# Altium project MPG2.PrjPcb
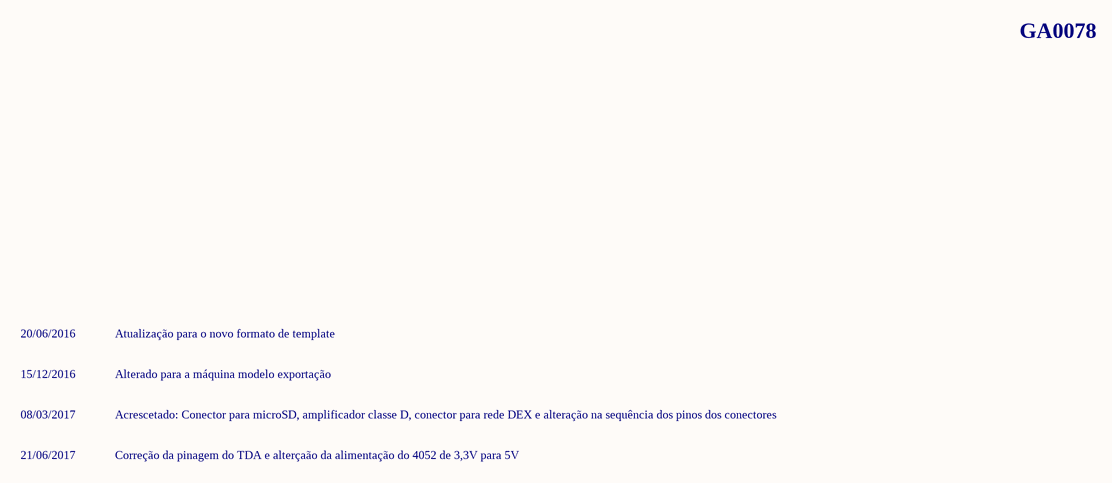
[diagram p0: Capa.SchDoc]
10 sheets, 183 parts. Net scope: global (net labels, ports and power ports of the same name join across sheets).
Sheets:
  Capa.SchDoc
  Controle_Cupula.SchDoc
  Controle_placa_potencia.SchDoc
  ControleEmbalagem.SchDoc
  ControleLeds.SchDoc
  Entrada_comestero_rm5.SchDoc
  Interface_gratis.SchDoc
  InterfaceConfiguracao.SchDoc
  Memoria.SchDoc
  Porta_MDB.SchDoc

## Sheet Capa.SchDoc: CONTROLADORA MAIS PIPOCA - REVISÃO EMC
size A3; Author: Marcos Aquino; DocumentNumber: 1; SheetNumber: 1; SheetTotal: 17; PageSetup: Record=PageOptions|CenterHorizontal=True|CenterVertical=True|PrintScale=0.71|XCorrection=1.00|YCorrection=1.00|PrintKind=0|BorderSize=5000000|LeftOffset=0|BottomOffset=0|Orientation=2|PaperLength=1000|PaperWidth=1000|Scale=100|PaperSource=7|PrintQuality=-3|MediaType=1|DitherType=10|PrintScaleMode=1|PaperKind=A4|PaperIndex=9

### Notes on the sheet
- GA0078
- 20/06/2016
- 15/12/2016
- Atualização para o novo formato de template
- Alterado para a máquina modelo exportação
- 08/03/2017
- Acrescetado: Conector para microSD, amplificador classe D, conector para rede DEX e alteração na sequência dos pinos dos conectores
- 21/06/2017
- Correção da pinagem do TDA e alterçaão da alimentação do 4052 de 3,3V para 5V
- Código
- Quark Tecnologia Eletrônica Ltda.
- Rua 216, nº 238 - Sala 01 - Meia Praia - Itapema/SC
- Observações
- (47) 3246-6352  -
- www.quarktee.com.br
- contato@quarktee.com.br
- Projeto
- Quantidade de Páginas
- Revisão
- Projetista
- Local arquivos no servidor
- Data
- Modificação
- Solicitador por:
- Executador por:
- Aprovado por:

## Sheet Controle_Cupula.SchDoc: CONTROLADORA MAIS PIPOCA - REVISÃO EMC
size A3; DocumentNumber: GA0078; SheetNumber: 6; SheetTotal: 17
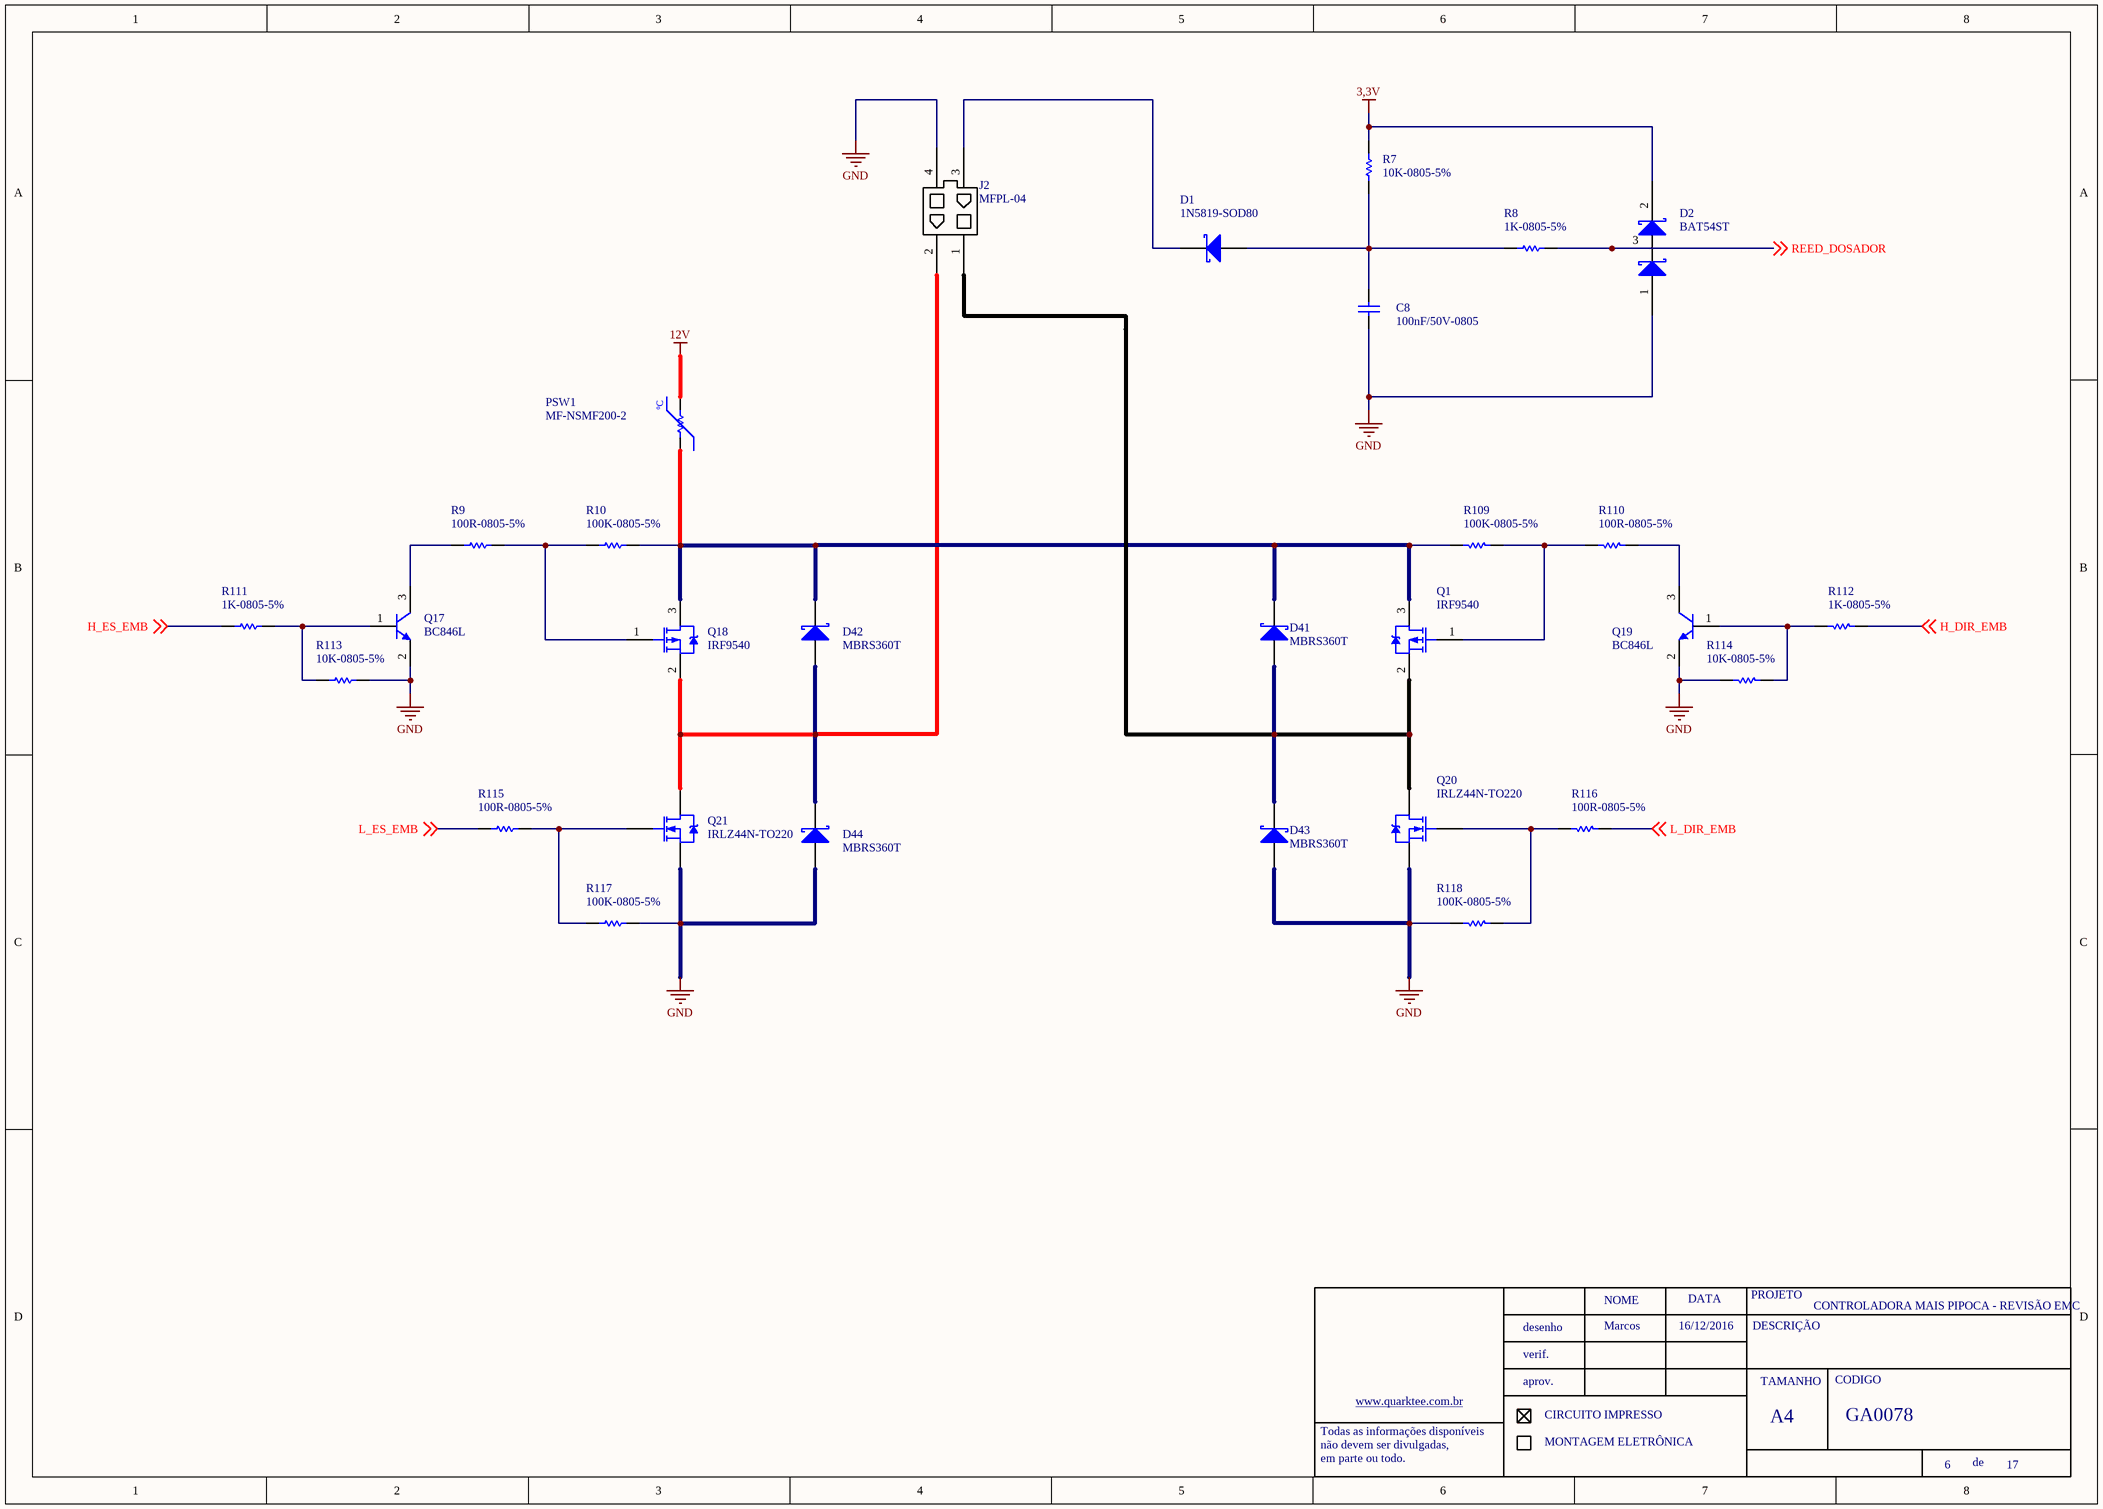
[diagram p1: Controle_Cupula.SchDoc]

### Parts
C8  100nF/50V-0805  [0805-REVISADO ONDA]
D1  1N5819-SOD80  [MINIMLEF/SOD80 - REVISADO ONDA]
D2  BAT54ST  [SOT23 - REVISADO ONDA]
D41  MBRS360T  [DO-214AB]
D42  MBRS360T  [DO-214AB]
D43  MBRS360T  [DO-214AB]
D44  MBRS360T  [DO-214AB]
J2  MFPL-04
PSW1  MF-NSMF200-2  [1206-REVISADO ONDA]
Q1  IRF9540  [TO220-3 EM PÉ]
Q17  BC846L  [SOT23 - REVISADO ONDA]
Q18  IRF9540  [TO220-3 EM PÉ]
Q19  BC846L  [SOT23 - REVISADO ONDA]
Q20  IRLZ44N-TO220  [TO220-3 EM PÉ]
Q21  IRLZ44N-TO220  [TO220-3 EM PÉ]
R7  10K-0805-5%  [0805-REVISADO ONDA]
R8  1K-0805-5%  [0805-REVISADO ONDA]
R9  100R-0805-5%  [0805-REVISADO ONDA]
R10  100K-0805-5%  [0805-REVISADO ONDA]
R109  100K-0805-5%  [0805-REVISADO ONDA]
R110  100R-0805-5%  [0805-REVISADO ONDA]
R111  1K-0805-5%  [0805-REVISADO ONDA]
R112  1K-0805-5%  [0805-REVISADO ONDA]
R113  10K-0805-5%  [0805-REVISADO ONDA]
R114  10K-0805-5%  [0805-REVISADO ONDA]
R115  100R-0805-5%  [0805-REVISADO ONDA]
R116  100R-0805-5%  [0805-REVISADO ONDA]
R117  100K-0805-5%  [0805-REVISADO ONDA]
R118  100K-0805-5%  [0805-REVISADO ONDA]

### Nets
3,3V: D2.2 R7.2
12V: PSW1.2
GND: C8.1 D2.1 D43.1(A) D44.1(A) J2.4 Q17.2(E) Q19.2(E) Q20.3(S) Q21.3(S) R113.2 R114.2 R117.2 R118.2
H_DIR_EMB: R112.1 ; off-sheet H_DIR_EMB
H_ES_EMB: R111.1 ; off-sheet H_ES_EMB
L_DIR_EMB: R116.1 ; off-sheet L_DIR_EMB
L_ES_EMB: R115.1 ; off-sheet L_ES_EMB
REED_DOSADOR: D2.3 R8.2 ; off-sheet REED_DOSADOR
NetC8_2: C8.2 D1.1(A) R7.1 R8.1
NetD1_2: D1.2(K) J2.3
NetD41_1: D41.1(A) D43.2(K) J2.1 Q1.2(DRENO) Q20.2(D)
NetD41_2: D41.2(K) D42.2(K) PSW1.1 Q1.3(SOURCE) Q18.3(SOURCE) R10.2 R109.2
NetD42_1: D42.1(A) D44.2(K) J2.2 Q18.2(DRENO) Q21.2(D)
NetQ1_1: Q1.1(GATE) R109.1 R110.2
NetQ17_1: Q17.1(B) R111.2 R113.1
NetQ17_3: Q17.3(C) R9.1
NetQ18_1: Q18.1(GATE) R9.2 R10.1
NetQ19_1: Q19.1(B) R112.2 R114.1
NetQ19_3: Q19.3(C) R110.1
NetQ20_1: Q20.1(G) R116.2 R118.1
NetQ21_1: Q21.1(G) R115.2 R117.1

### Notes on the sheet
- Marcos
- 16/12/2016
- NOME
- DATA
- PROJETO
- DESCRIÇÃO
- desenho
- verif.
- aprov.
- TAMANHO
- CODIGO
- Todas as informações disponíveis
- não devem ser divulgadas,
- em parte ou todo.
- www.quarktee.com.br
- CIRCUITO IMPRESSO
- MONTAGEM ELETRÔNICA
- A4
- de
- (in symbol POLYSWITCH 200mA) ºC

### Library data of the parts
C8 = 100nF/50-0805-NPO: ERP: 104.11.005
D41-D44 = 1N5819-SOD80: ERP: 121.18.003
PSW1 = POLYSWITCH 200mA: NANOSMDC020F-2; ERP: 128.12.002
Q17 Q19 = BC846: ERP: 106.22.001
R9 R110 = 1K-0805-5%: ERP: 102.11.042
R111 R112 = 10K-0805-5%: ERP: 102.11.054
D1 = 1N5819-SOD80: ERP: 121.18.003
Q20 Q21 = IRLZ44N-TO220: ERP: 107.01.006
R7 R113 R114 = 10K-0805-5%: ERP: 102.11.054
R8 = 1K-0805-5%: ERP: 102.11.042
R10 R109 R117 R118 = 100K-0805-5%: ERP: 102.11.066
R115 R116 = 100R-0805-5%: ERP: 102.11.031

## Sheet Controle_placa_potencia.SchDoc: CONTROLADORA MAIS PIPOCA - REVISÃO EMC
size A3; DocumentNumber: GA0078; SheetNumber: 8; SheetTotal: 17
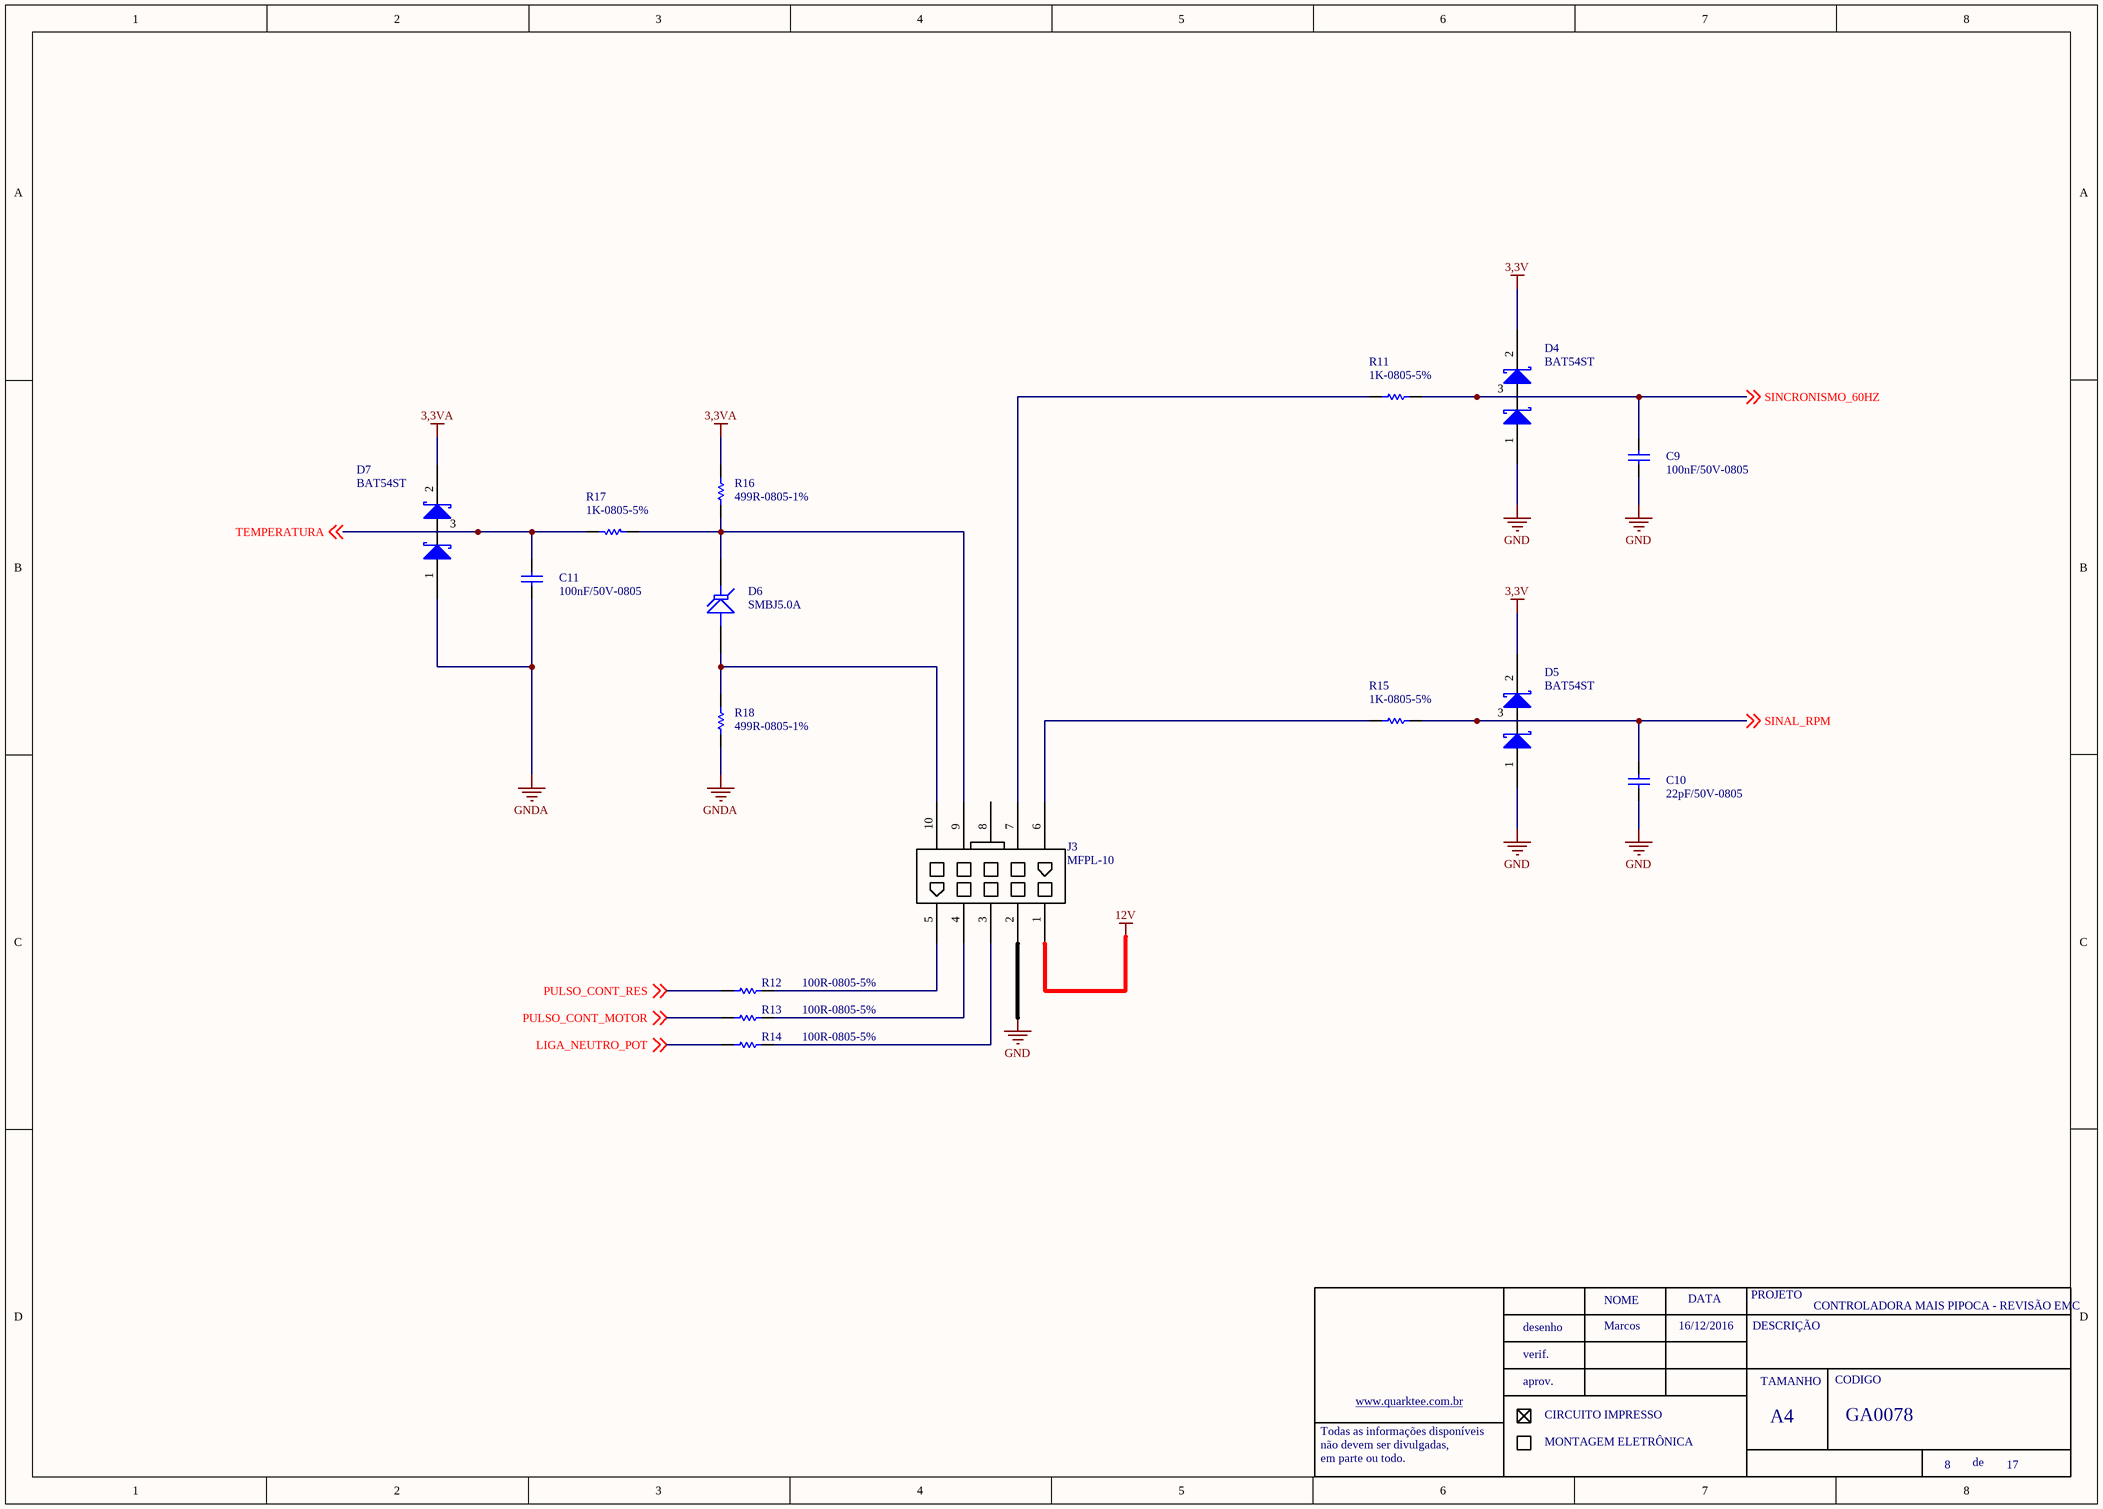
[diagram p2: Controle_placa_potencia.SchDoc]

### Parts
C9  100nF/50V-0805  [0805-REVISADO ONDA]
C10  22pF/50V-0805  [0805-REVISADO ONDA]
C11  100nF/50V-0805  [0805-REVISADO ONDA]
D4  BAT54ST  [SOT23 - REVISADO ONDA]
D5  BAT54ST  [SOT23 - REVISADO ONDA]
D6  SMBJ5.0A  [SMA DIODES]
D7  BAT54ST  [SOT23 - REVISADO ONDA]
J3  MFPL-10
R11  1K-0805-5%  [0805-REVISADO ONDA]
R12  100R-0805-5%  [0805-REVISADO ONDA]
R13  100R-0805-5%  [0805-REVISADO ONDA]
R14  100R-0805-5%  [0805-REVISADO ONDA]
R15  1K-0805-5%  [0805-REVISADO ONDA]
R16  499R-0805-1%  [0805-REVISADO ONDA]
R17  1K-0805-5%  [0805-REVISADO ONDA]
R18  499R-0805-1%  [0805-REVISADO ONDA]

### Nets
3,3V: D4.2 D5.2
3,3VA: D7.2 R16.2
12V: J3.1
GND: C9.2 C10.2 D4.1 D5.1 J3.2
GNDA: C11.1 D7.1 R18.1
LIGA_NEUTRO_POT: R14.1 ; off-sheet LIGA_NEUTRO_POT
PULSO_CONT_MOTOR: R13.1 ; off-sheet PULSO_CONT_MOTOR
PULSO_CONT_RES: R12.2 ; off-sheet PULSO_CONT_RES
SINAL_RPM: C10.1 D5.3 R15.2 ; off-sheet SINAL_RPM
SINCRONISMO_60HZ: C9.1 D4.3 R11.2 ; off-sheet SINCRONISMO_60HZ
TEMPERATURA: C11.2 D7.3 R17.2 ; off-sheet TEMPERATURA
NetD6_1: D6.1(A) J3.10 R18.2
NetD6_2: D6.2(K) J3.9 R16.1 R17.1
NetJ3_3: J3.3 R14.2
NetJ3_4: J3.4 R13.2
NetJ3_5: J3.5 R12.1
NetJ3_6: J3.6 R15.1
NetJ3_7: J3.7 R11.1

Not connected (* = marked no-connect by the designer): J3 8

### Notes on the sheet
- Marcos
- 16/12/2016
- NOME
- DATA
- PROJETO
- DESCRIÇÃO
- desenho
- verif.
- aprov.
- TAMANHO
- CODIGO
- Todas as informações disponíveis
- não devem ser divulgadas,
- em parte ou todo.
- www.quarktee.com.br
- CIRCUITO IMPRESSO
- MONTAGEM ELETRÔNICA
- A4
- de

### Library data of the parts
C9 C11 = 100nF/50-0805-NPO: ERP: 104.11.005
C10 = 100nF/50-0805-NPO: 100nF/50V-0805; ERP: 104.11.005
R16 R18 = 10K-0805-5%: ERP: 102.11.054
D6 = SMBJ5.0A: ERP: 128.02.002
R11 R15 R17 = 1K-0805-5%: ERP: 102.11.042
R12-R14 = 100R-0805-5%: ERP: 102.11.031

## Sheet ControleEmbalagem.SchDoc: CONTROLADORA MAIS PIPOCA - REVISÃO EMC
size A3; DocumentNumber: GA0078; SheetNumber: 5; SheetTotal: 17
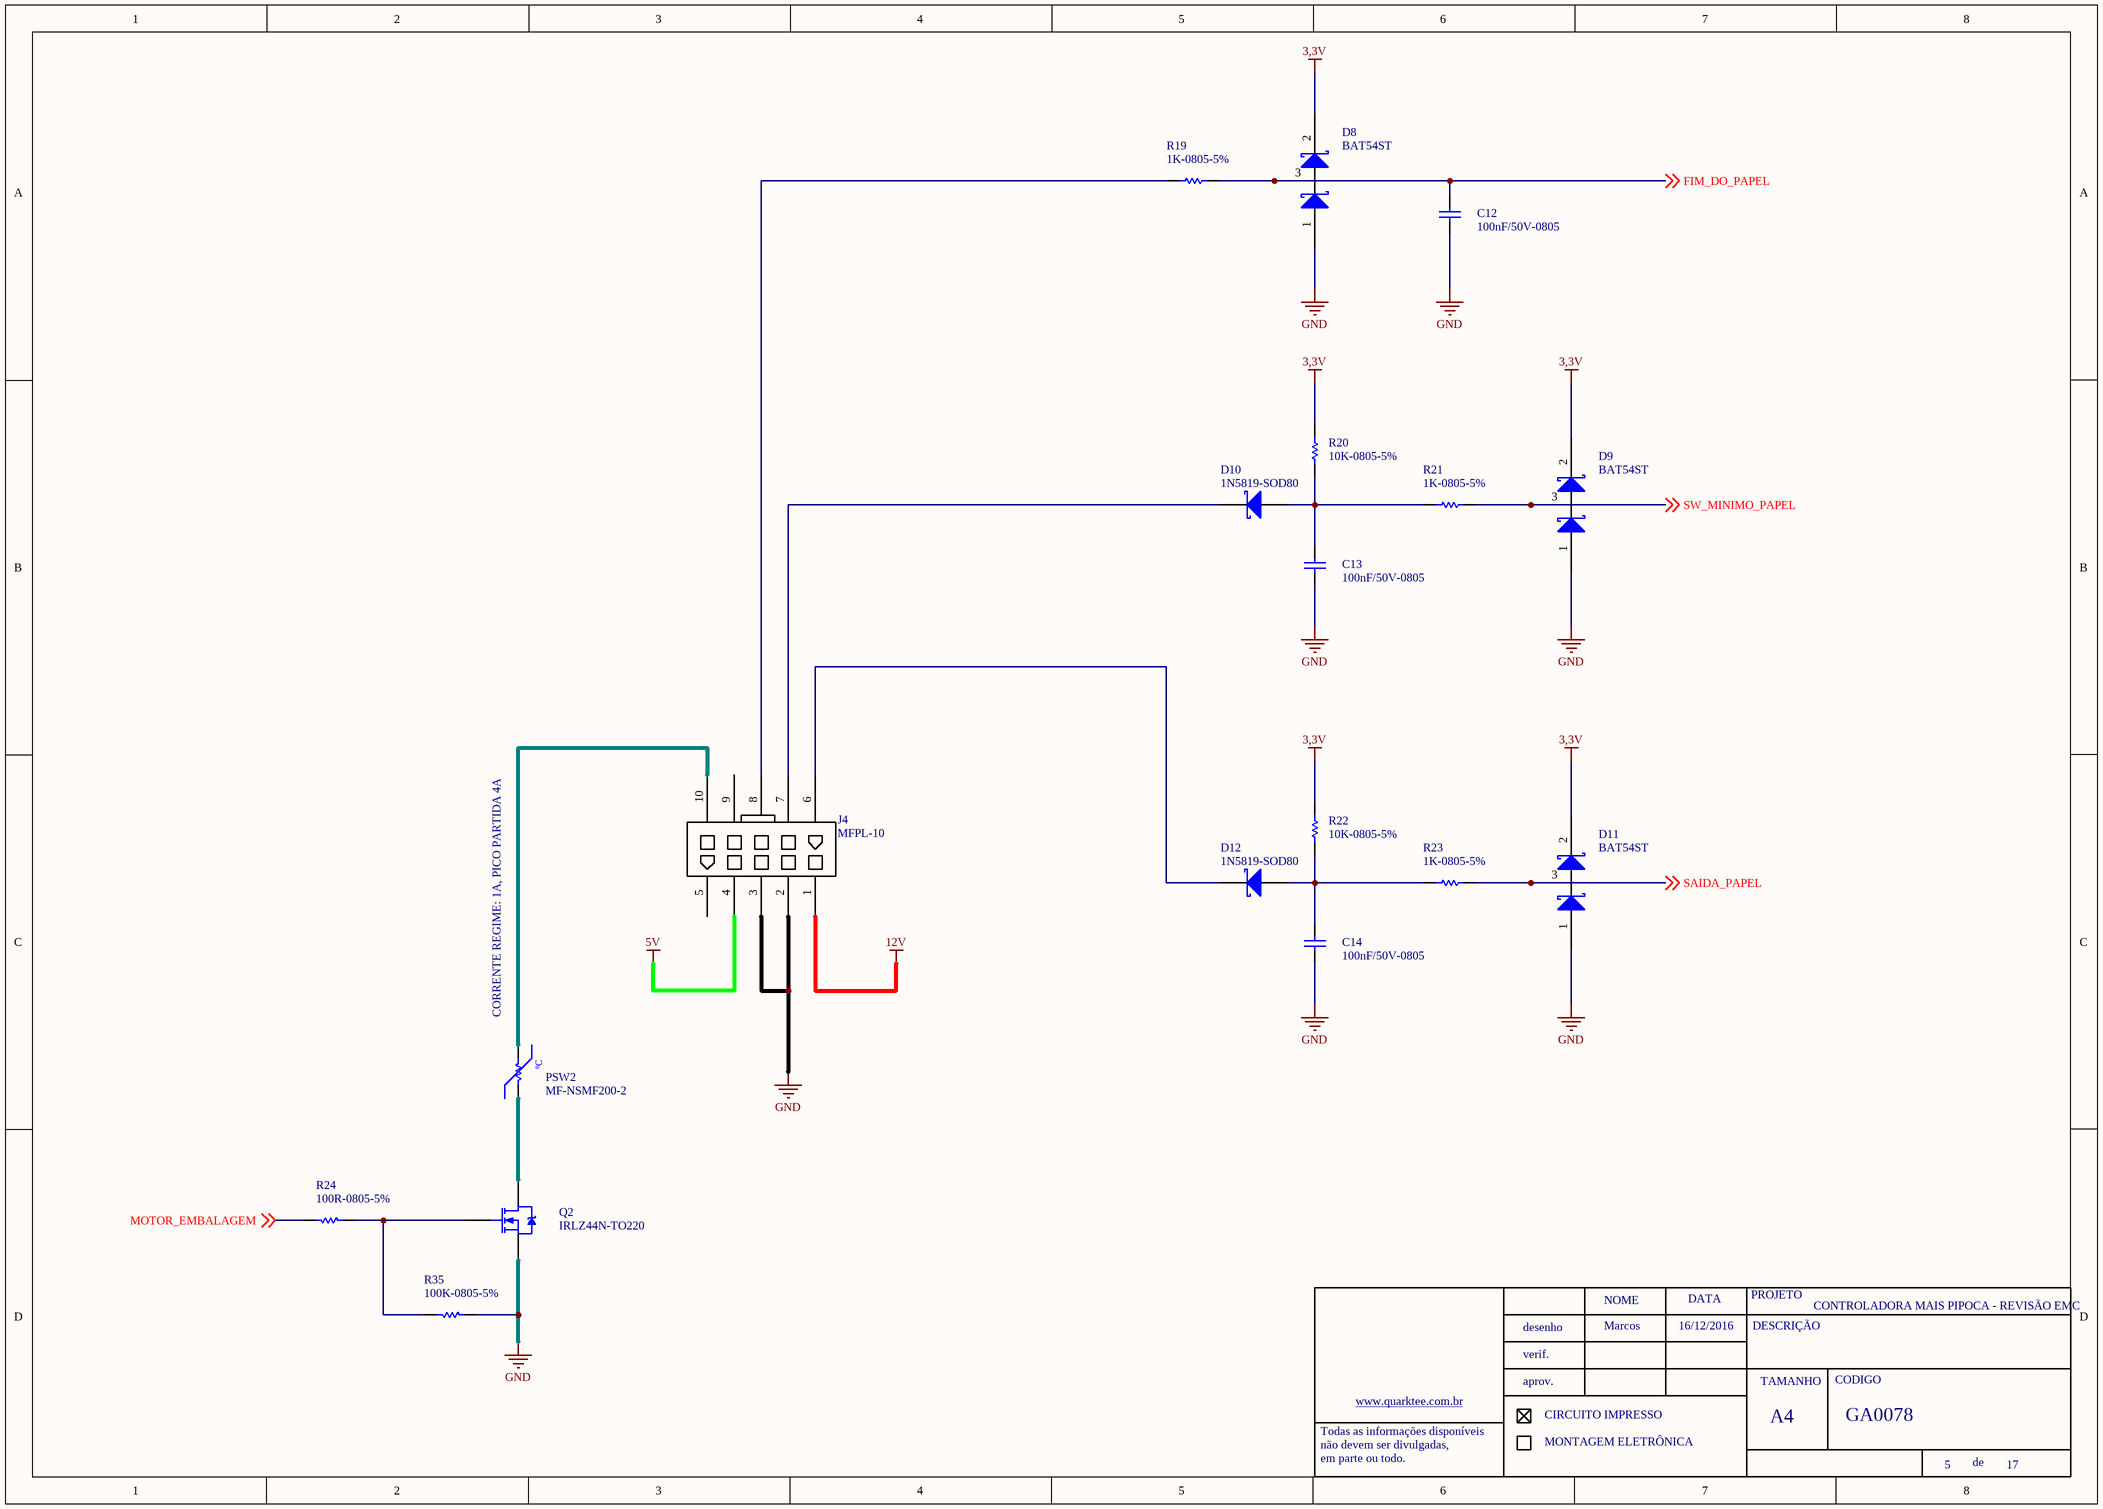
[diagram p3: ControleEmbalagem.SchDoc]

### Parts
C12  100nF/50V-0805  [0805-REVISADO ONDA]
C13  100nF/50V-0805  [0805-REVISADO ONDA]
C14  100nF/50V-0805  [0805-REVISADO ONDA]
D8  BAT54ST  [SOT23 - REVISADO ONDA]
D9  BAT54ST  [SOT23 - REVISADO ONDA]
D10  1N5819-SOD80  [MINIMLEF/SOD80 - REVISADO ONDA]
D11  BAT54ST  [SOT23 - REVISADO ONDA]
D12  1N5819-SOD80  [MINIMLEF/SOD80 - REVISADO ONDA]
J4  MFPL-10
PSW2  MF-NSMF200-2  [1206-REVISADO ONDA]
Q2  IRLZ44N-TO220  [TO220-3 EM PÉ]
R19  1K-0805-5%  [0805-REVISADO ONDA]
R20  10K-0805-5%  [0805-REVISADO ONDA]
R21  1K-0805-5%  [0805-REVISADO ONDA]
R22  10K-0805-5%  [0805-REVISADO ONDA]
R23  1K-0805-5%  [0805-REVISADO ONDA]
R24  100R-0805-5%  [0805-REVISADO ONDA]
R35  100K-0805-5%  [0805-REVISADO ONDA]

### Nets
3,3V: D8.2 D9.2 D11.2 R20.2 R22.2
5V: J4.4
12V: J4.1
GND: C12.1 C13.1 C14.1 D8.1 D9.1 D11.1 J4.2 J4.3 Q2.3(S) R35.1
FIM_DO_PAPEL: C12.2 D8.3 R19.2 ; off-sheet FIM_DO_PAPEL
MOTOR_EMBALAGEM: R24.2 ; off-sheet MOTOR_EMBALAGEM
SAIDA_PAPEL: D11.3 R23.2 ; off-sheet SAIDA_PAPEL
SW_MINIMO_PAPEL: D9.3 R21.2 ; off-sheet SW_MINIMO_PAPEL
NetC13_2: C13.2 D10.1(A) R20.1 R21.1
NetC14_2: C14.2 D12.1(A) R22.1 R23.1
NetD10_2: D10.2(K) J4.7
NetD12_2: D12.2(K) J4.6
NetJ4_8: J4.8 R19.1
NetJ4_10: J4.10 PSW2.2
NetPSW2_1: PSW2.1 Q2.2(D)
NetQ2_1: Q2.1(G) R24.1 R35.2

Not connected (* = marked no-connect by the designer): J4 5 9

### Notes on the sheet
- (near PSW2) CORRENTE REGIME: 1A, PICO PARTIDA 4A
- Marcos
- 16/12/2016
- NOME
- DATA
- PROJETO
- DESCRIÇÃO
- desenho
- verif.
- aprov.
- TAMANHO
- CODIGO
- Todas as informações disponíveis
- não devem ser divulgadas,
- em parte ou todo.
- www.quarktee.com.br
- CIRCUITO IMPRESSO
- MONTAGEM ELETRÔNICA
- A4
- de
- (in symbol POLYSWITCH 200mA) ºC

### Library data of the parts
C12-C14 = 100nF/50-0805-NPO: ERP: 104.11.005
PSW2 = POLYSWITCH 200mA: NANOSMDC020F-2; ERP: 128.12.002
D10 D12 = 1N5819-SOD80: ERP: 121.18.003
Q2 = IRLZ44N-TO220: ERP: 107.01.006
R19 R21 R23 = 1K-0805-5%: ERP: 102.11.042
R20 R22 = 10K-0805-5%: ERP: 102.11.054
R24 = 100R-0805-5%: ERP: 102.11.031
R35 = 100K-0805-5%: ERP: 102.11.066

## Sheet ControleLeds.SchDoc: CONTROLADORA MAIS PIPOCA - REVISÃO EMC
size A3; DocumentNumber: GA0078; SheetNumber: 7; SheetTotal: 17
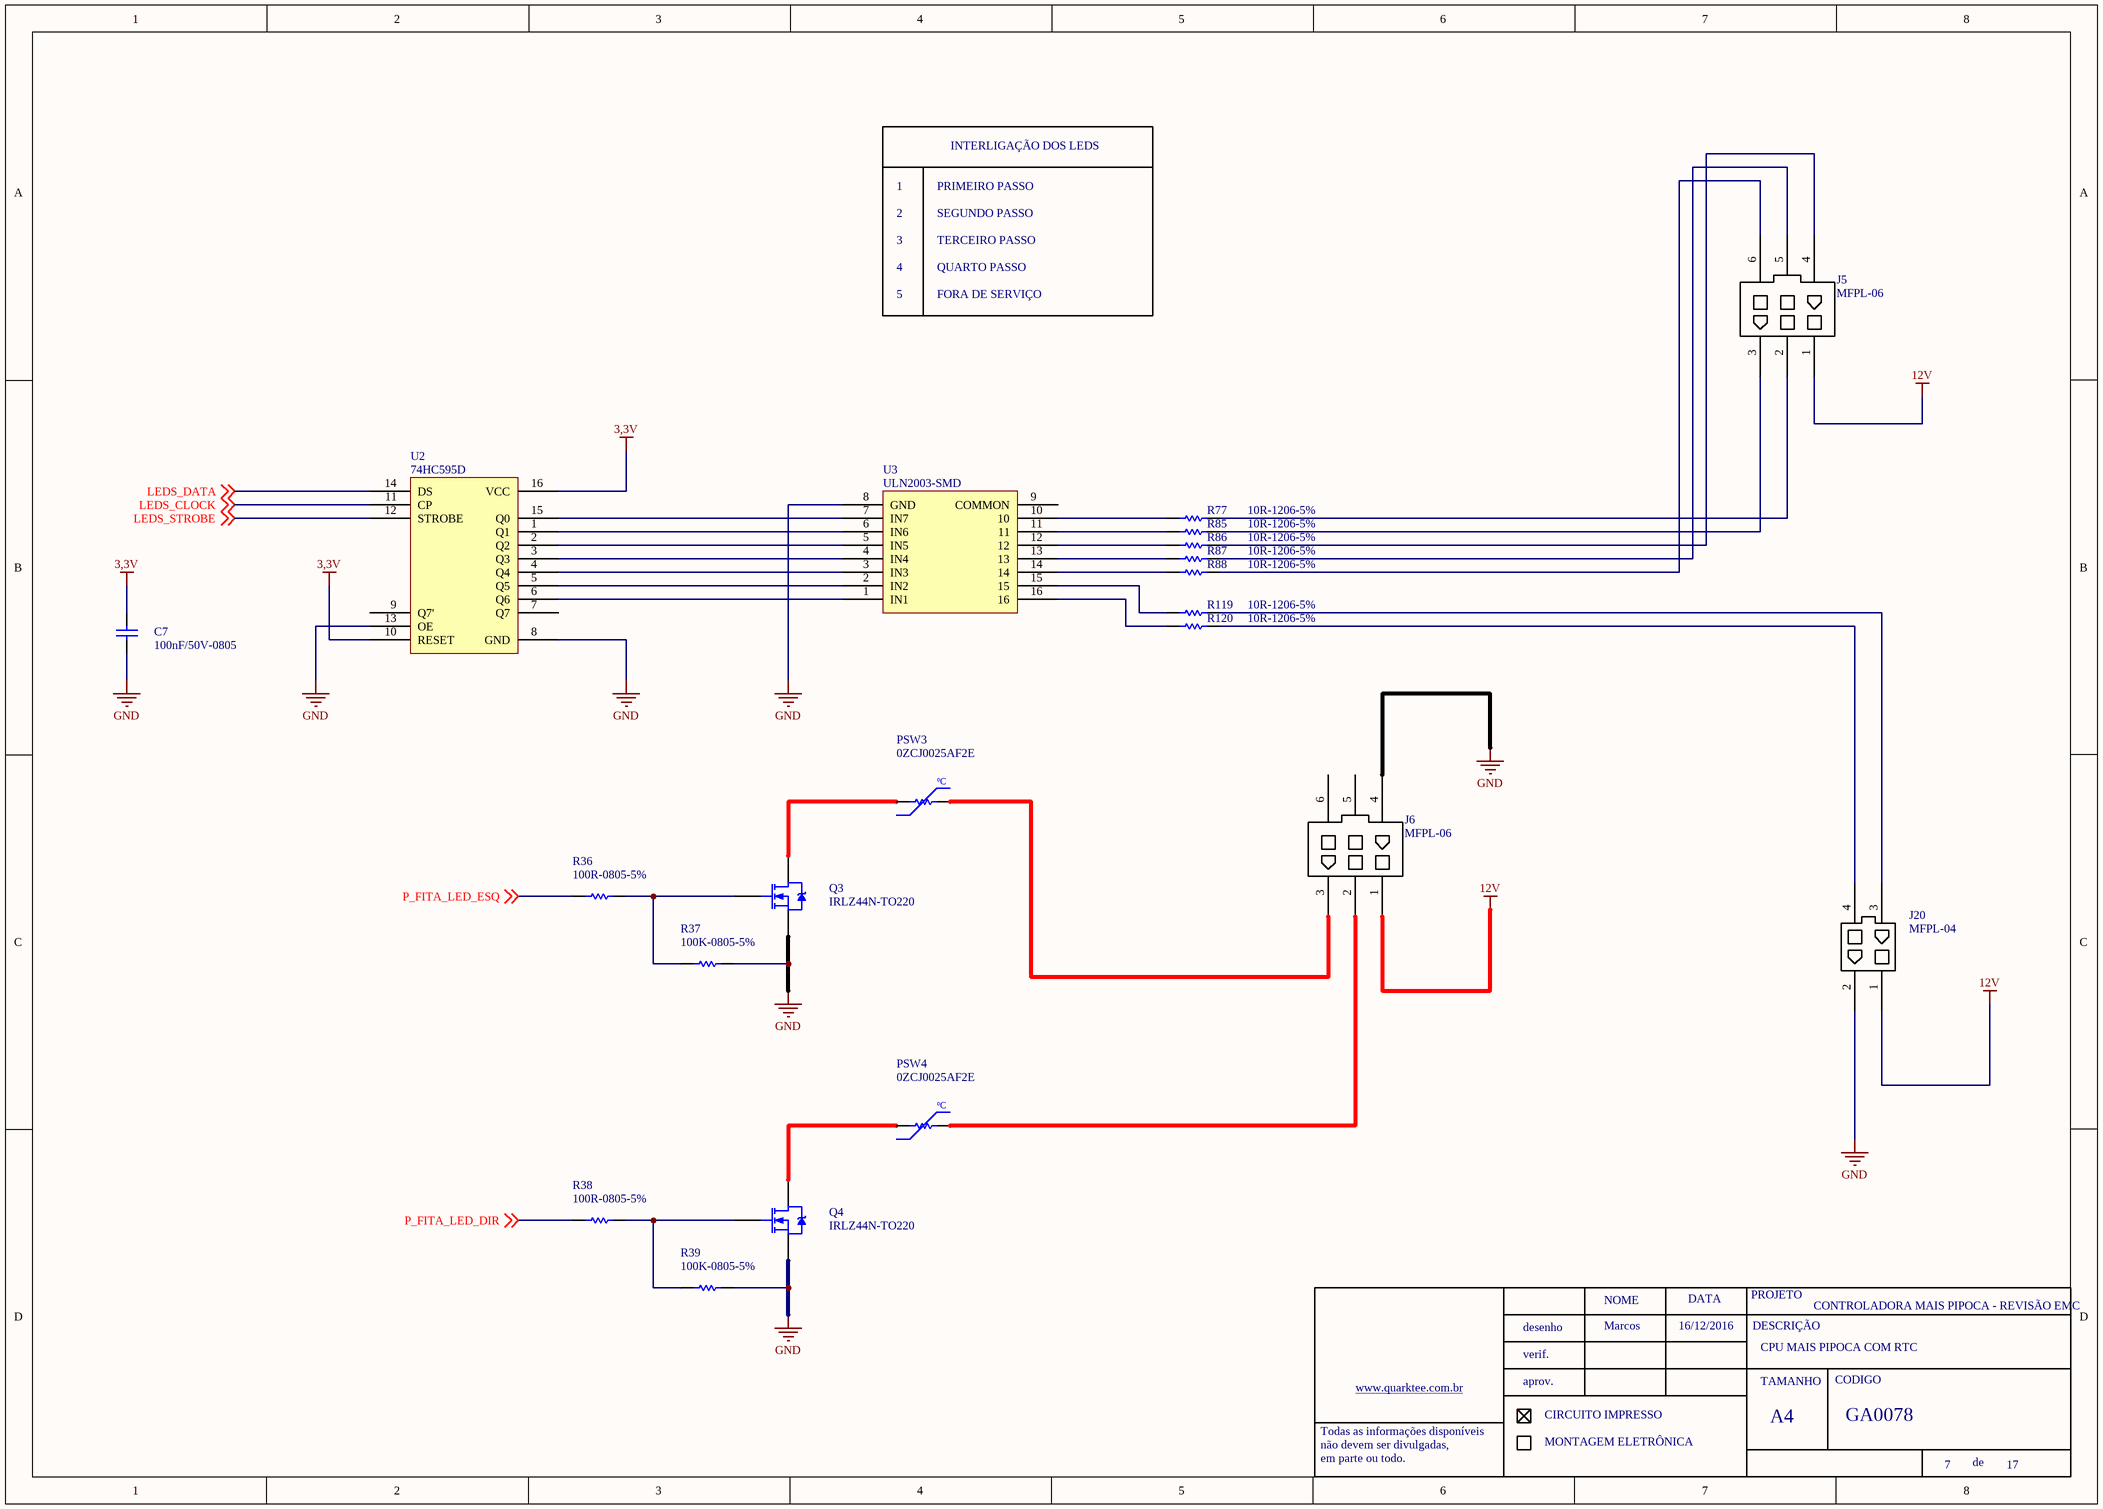
[diagram p4: ControleLeds.SchDoc]

### Parts
C7  100nF/50V-0805  [0805-REVISADO ONDA]
J5  MFPL-06
J6  MFPL-06
J20  MFPL-04
PSW3  0ZCJ0025AF2E  [1206-REVISADO ONDA]
PSW4  0ZCJ0025AF2E  [1206-REVISADO ONDA]
Q3  IRLZ44N-TO220  [TO220-3 EM PÉ]
Q4  IRLZ44N-TO220  [TO220-3 EM PÉ]
R36  100R-0805-5%  [0805-REVISADO ONDA]
R37  100K-0805-5%  [0805-REVISADO ONDA]
R38  100R-0805-5%  [0805-REVISADO ONDA]
R39  100K-0805-5%  [0805-REVISADO ONDA]
R77  10R-1206-5%  [1206-REVISADO ONDA]
R85  10R-1206-5%  [1206-REVISADO ONDA]
R86  10R-1206-5%  [1206-REVISADO ONDA]
R87  10R-1206-5%  [1206-REVISADO ONDA]
R88  10R-1206-5%  [1206-REVISADO ONDA]
R119  10R-1206-5%  [1206-REVISADO ONDA]
R120  10R-1206-5%  [1206-REVISADO ONDA]
U2  74HC595D  [SOIC 16 PINOS]
U3  ULN2003-SMD  [SOIC 16 PINOS]

### Nets
3,3V: C7.2 U2.10(RESET) U2.16(VCC)
12V: J5.1 J6.1 J20.1
GND: C7.1 J6.4 J20.2 Q3.3(S) Q4.3(S) R37.2 R39.2 U2.8(GND) U2.13(OE) U3.8(GND)
LEDS_CLOCK: U2.11(CP) ; off-sheet LEDS_CLOCK
LEDS_DATA: U2.14(DS) ; off-sheet LEDS_DATA
LEDS_STROBE: U2.12(STROBE) ; off-sheet LEDS_STROBE
P_FITA_LED_DIR: R38.1 ; off-sheet P_FITA_LED_DIR
P_FITA_LED_ESQ: R36.1 ; off-sheet P_FITA_LED_ESQ
NetJ5_2: J5.2 R77.2
NetJ5_3: J5.3 R85.2
NetJ5_4: J5.4 R86.2
NetJ5_5: J5.5 R87.2
NetJ5_6: J5.6 R88.2
NetJ6_2: J6.2 PSW4.2
NetJ6_3: J6.3 PSW3.2
NetJ20_3: J20.3 R119.2
NetJ20_4: J20.4 R120.2
NetPSW3_1: PSW3.1 Q3.2(D)
NetPSW4_1: PSW4.1 Q4.2(D)
NetQ3_1: Q3.1(G) R36.2 R37.1
NetQ4_1: Q4.1(G) R38.2 R39.1
NetR77_1: R77.1 U3.10
NetR85_1: R85.1 U3.11
NetR86_1: R86.1 U3.12
NetR87_1: R87.1 U3.13
NetR88_1: R88.1 U3.14
NetR119_1: R119.1 U3.15
NetR120_1: R120.1 U3.16
NetU2_1: U2.1(Q1) U3.6(IN6)
NetU2_2: U2.2(Q2) U3.5(IN5)
NetU2_3: U2.3(Q3) U3.4(IN4)
NetU2_4: U2.4(Q4) U3.3(IN3)
NetU2_5: U2.5(Q5) U3.2(IN2)
NetU2_6: U2.6(Q6) U3.1(IN1)
NetU2_15: U2.15(Q0) U3.7(IN7)

Not connected (* = marked no-connect by the designer): J6 5 6; U2 7(Q7) 9(Q7'); U3 9(COMMON)

### Notes on the sheet
- INTERLIGAÇÃO DOS LEDS
- 1
- 2
- 3
- PRIMEIRO PASSO
- SEGUNDO PASSO
- TERCEIRO PASSO
- 4
- 5
- QUARTO PASSO
- FORA DE SERVIÇO
- Marcos
- 16/12/2016
- CPU MAIS PIPOCA COM RTC
- NOME
- DATA
- PROJETO
- DESCRIÇÃO
- www.quarktee.com.br
- desenho
- verif.
- aprov.
- TAMANHO
- CODIGO
- Todas as informações disponíveis
- não devem ser divulgadas,
- em parte ou todo.
- CIRCUITO IMPRESSO
- MONTAGEM ELETRÔNICA
- A4
- de
- (in symbol PTC 2A-120V) ºC

### Library data of the parts
C7 = 100nF/50-0805-NPO: ERP: 104.11.005
PSW3 PSW4 = PTC 2A-120V
R77 R85-R88 R119 R120 = 10R-0805-5%
U2 = 74HC595D: ERP: CADASTRAR
U3 = ULN2003
Q3 Q4 = IRLZ44N-TO220: ERP: 107.01.006
R36 R38 = 100R-0805-5%: ERP: 102.11.031
R37 R39 = 100K-0805-5%: ERP: 102.11.066

## Sheet Entrada_comestero_rm5.SchDoc: CONTROLADORA MAIS PIPOCA - REVISÃO EMC
size A3; DocumentNumber: GA0078; SheetNumber: 12; SheetTotal: 17
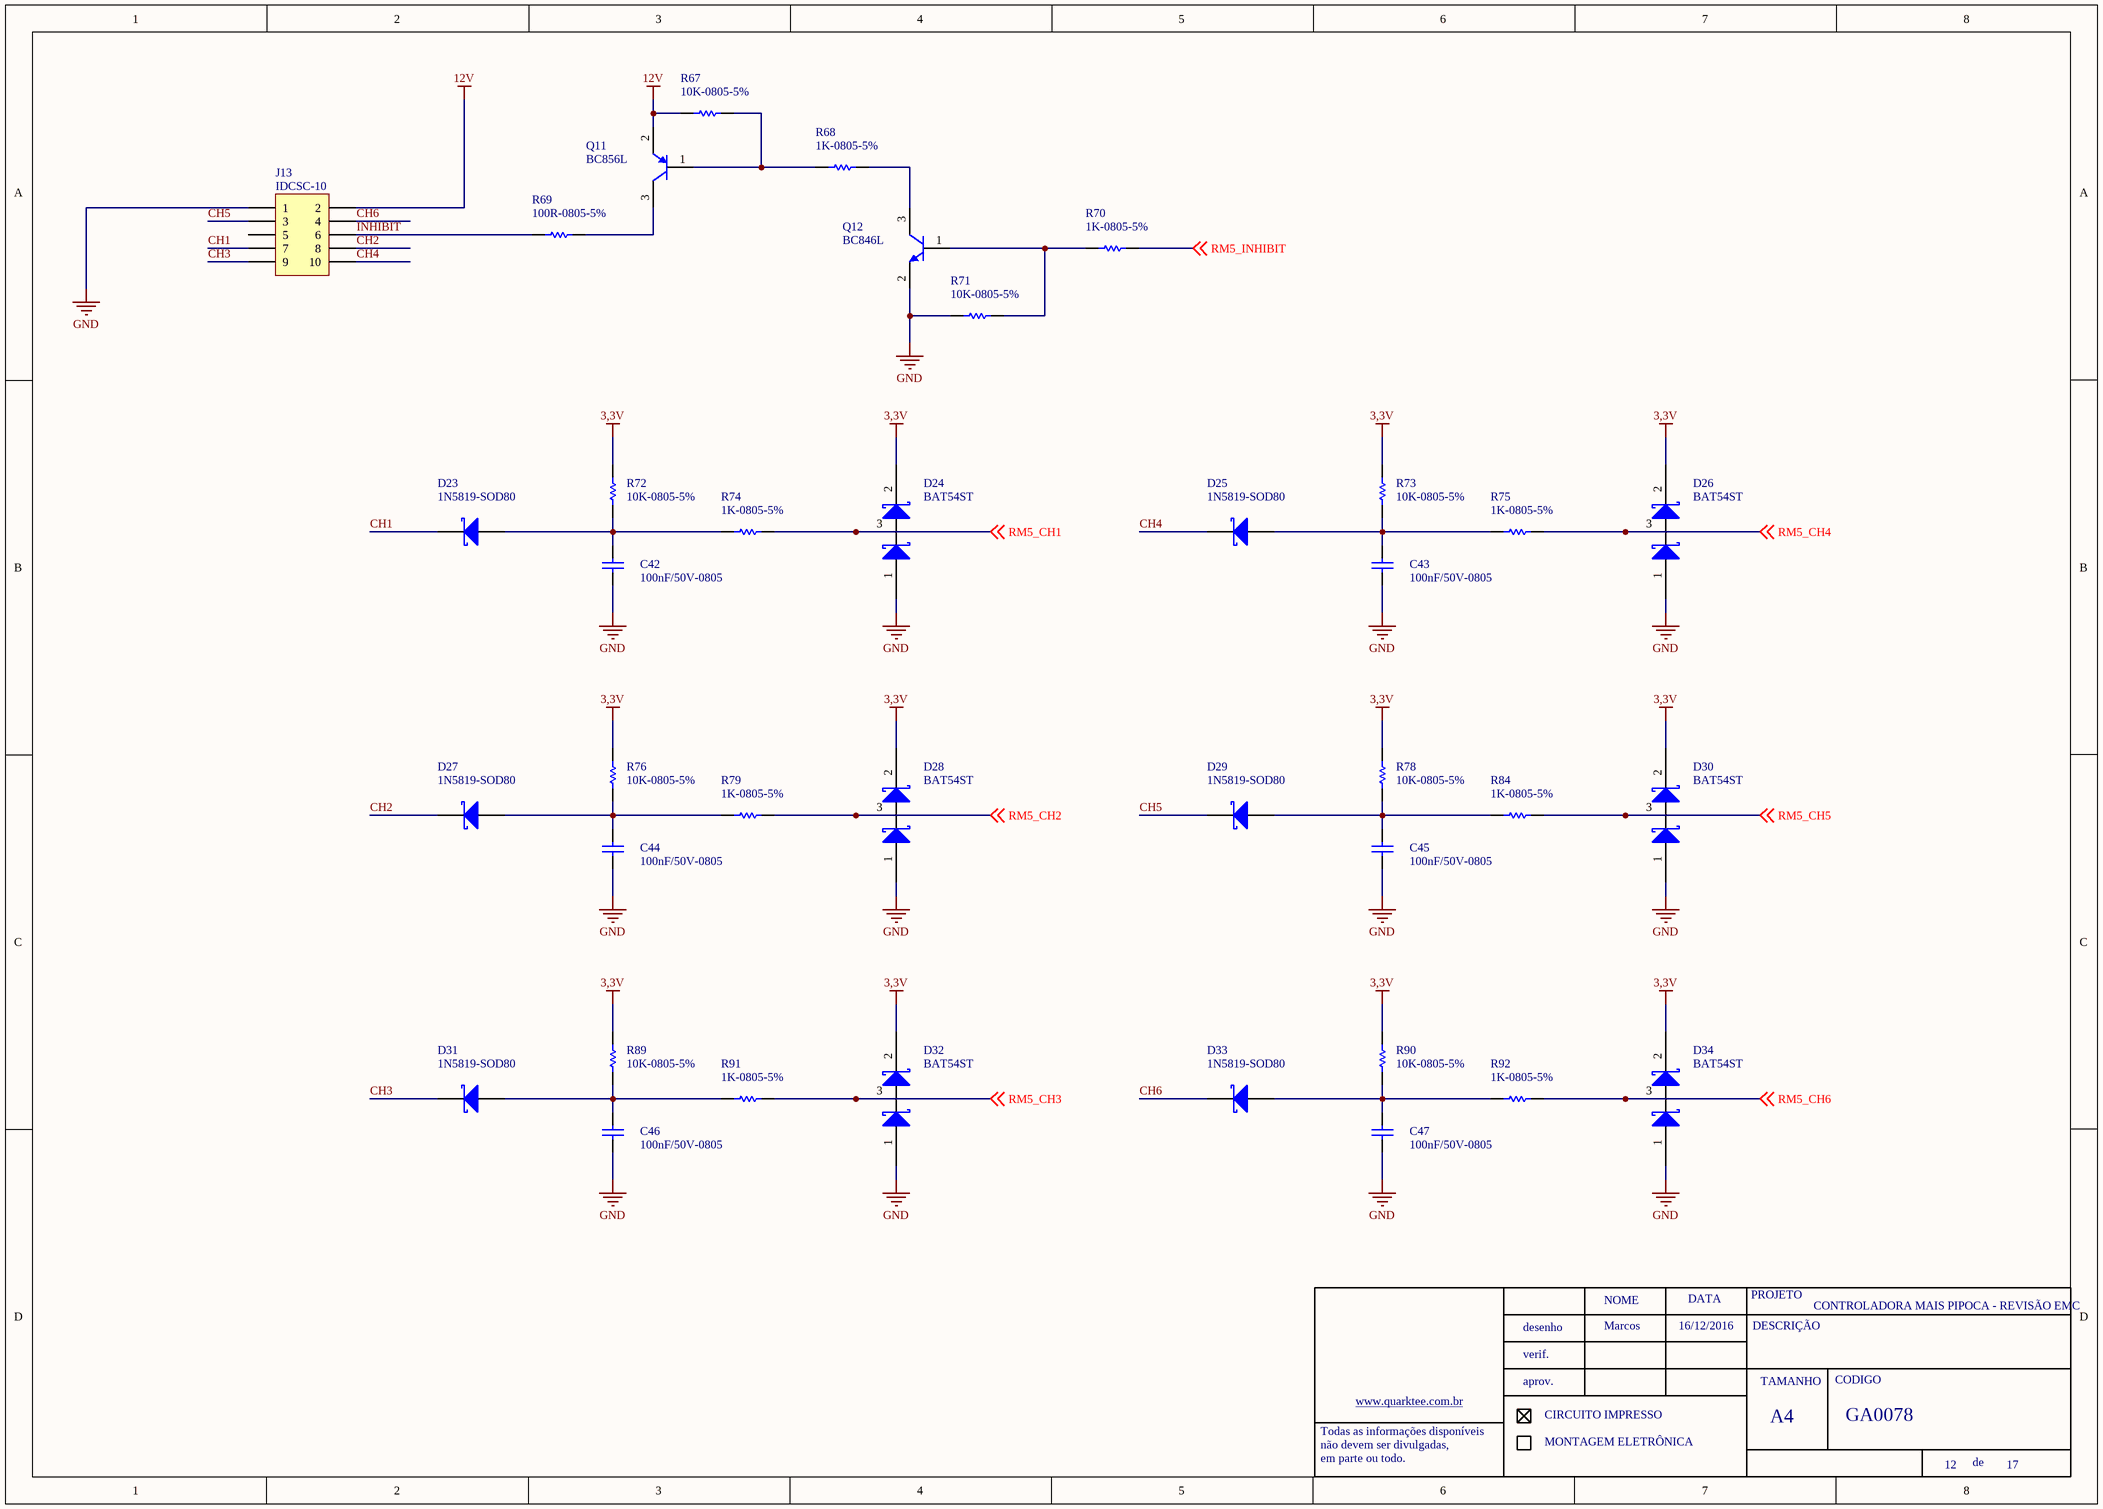
[diagram p5: Entrada_comestero_rm5.SchDoc]

### Parts
C42  100nF/50V-0805  [0805-REVISADO ONDA]
C43  100nF/50V-0805  [0805-REVISADO ONDA]
C44  100nF/50V-0805  [0805-REVISADO ONDA]
C45  100nF/50V-0805  [0805-REVISADO ONDA]
C46  100nF/50V-0805  [0805-REVISADO ONDA]
C47  100nF/50V-0805  [0805-REVISADO ONDA]
D23  1N5819-SOD80  [MINIMLEF/SOD80 - REVISADO ONDA]
D24  BAT54ST  [SOT23 - REVISADO ONDA]
D25  1N5819-SOD80  [MINIMLEF/SOD80 - REVISADO ONDA]
D26  BAT54ST  [SOT23 - REVISADO ONDA]
D27  1N5819-SOD80  [MINIMLEF/SOD80 - REVISADO ONDA]
D28  BAT54ST  [SOT23 - REVISADO ONDA]
D29  1N5819-SOD80  [MINIMLEF/SOD80 - REVISADO ONDA]
D30  BAT54ST  [SOT23 - REVISADO ONDA]
D31  1N5819-SOD80  [MINIMLEF/SOD80 - REVISADO ONDA]
D32  BAT54ST  [SOT23 - REVISADO ONDA]
D33  1N5819-SOD80  [MINIMLEF/SOD80 - REVISADO ONDA]
D34  BAT54ST  [SOT23 - REVISADO ONDA]
J13  IDCSC-10  [IDCSC-10]
Q11  BC856L  [SOT23 - REVISADO ONDA]
Q12  BC846L  [SOT23 - REVISADO ONDA]
R67  10K-0805-5%  [0805-REVISADO ONDA]
R68  1K-0805-5%  [0805-REVISADO ONDA]
R69  100R-0805-5%  [0805-REVISADO ONDA]
R70  1K-0805-5%  [0805-REVISADO ONDA]
R71  10K-0805-5%  [0805-REVISADO ONDA]
R72  10K-0805-5%  [0805-REVISADO ONDA]
R73  10K-0805-5%  [0805-REVISADO ONDA]
R74  1K-0805-5%  [0805-REVISADO ONDA]
R75  1K-0805-5%  [0805-REVISADO ONDA]
R76  10K-0805-5%  [0805-REVISADO ONDA]
R78  10K-0805-5%  [0805-REVISADO ONDA]
R79  1K-0805-5%  [0805-REVISADO ONDA]
R84  1K-0805-5%  [0805-REVISADO ONDA]
R89  10K-0805-5%  [0805-REVISADO ONDA]
R90  10K-0805-5%  [0805-REVISADO ONDA]
R91  1K-0805-5%  [0805-REVISADO ONDA]
R92  1K-0805-5%  [0805-REVISADO ONDA]

### Nets
3,3V: D24.2 D26.2 D28.2 D30.2 D32.2 D34.2 R72.2 R73.2 R76.2 R78.2 R89.2 R90.2
12V: J13.2 Q11.2(E) R67.1
GND: C42.1 C43.1 C44.1 C45.1 C46.1 C47.1 D24.1 D26.1 D28.1 D30.1 D32.1 D34.1 J13.1 Q12.2(E) R71.1
CH1: D23.2(K) J13.7
CH2: D27.2(K) J13.8
CH3: D31.2(K) J13.9
CH4: D25.2(K) J13.10
CH5: D29.2(K) J13.3
CH6: D33.2(K) J13.4
INHIBIT: J13.6 R69.1
RM5_CH1: D24.3 R74.2 ; off-sheet RM5_CH1
RM5_CH2: D28.3 R79.2 ; off-sheet RM5_CH2
RM5_CH3: D32.3 R91.2 ; off-sheet RM5_CH3
RM5_CH4: D26.3 R75.2 ; off-sheet RM5_CH4
RM5_CH5: D30.3 R84.2 ; off-sheet RM5_CH5
RM5_CH6: D34.3 R92.2 ; off-sheet RM5_CH6
RM5_INHIBIT: R70.2 ; off-sheet RM5_INHIBIT
NetC42_2: C42.2 D23.1(A) R72.1 R74.1
NetC43_2: C43.2 D25.1(A) R73.1 R75.1
NetC44_2: C44.2 D27.1(A) R76.1 R79.1
NetC45_2: C45.2 D29.1(A) R78.1 R84.1
NetC46_2: C46.2 D31.1(A) R89.1 R91.1
NetC47_2: C47.2 D33.1(A) R90.1 R92.1
NetQ11_1: Q11.1(B) R67.2 R68.1
NetQ11_3: Q11.3(C) R69.2
NetQ12_1: Q12.1(B) R70.1 R71.2
NetQ12_3: Q12.3(C) R68.2

Not connected (* = marked no-connect by the designer): J13 5

### Notes on the sheet
- Marcos
- 16/12/2016
- NOME
- DATA
- PROJETO
- DESCRIÇÃO
- desenho
- verif.
- aprov.
- TAMANHO
- CODIGO
- Todas as informações disponíveis
- não devem ser divulgadas,
- em parte ou todo.
- www.quarktee.com.br
- CIRCUITO IMPRESSO
- MONTAGEM ELETRÔNICA
- A4
- de

### Library data of the parts
C42-C47 = 100nF/50-0805-NPO: ERP: 104.11.005
D24 D26 D28 D30 D32 D34 = BA54
J13 = IDCSN: CONECTOR HEADER 10 VIAS 90º; ERP: 435.00.009
Q12 = BC846: ERP: 106.22.001
R70 = 100R-0805-5%: ERP: 102.11.031
D23 D25 D27 D29 D31 D33 = 1N5819-SOD80: ERP: 121.18.003
Q11 = BC856L: ERP: 106.22.002
R67 R71-R73 R76 R78 R89 R90 = 10K-0805-5%: ERP: 102.11.054
R68 R74 R75 R79 R84 R91 R92 = 1K-0805-5%: ERP: 102.11.042
R69 = 100R-0805-5%: ERP: 102.11.031

## Sheet Interface_gratis.SchDoc: CONTROLADORA MAIS PIPOCA - REVISÃO EMC
size A3; DocumentNumber: GA0078; SheetNumber: 17; SheetTotal: 17
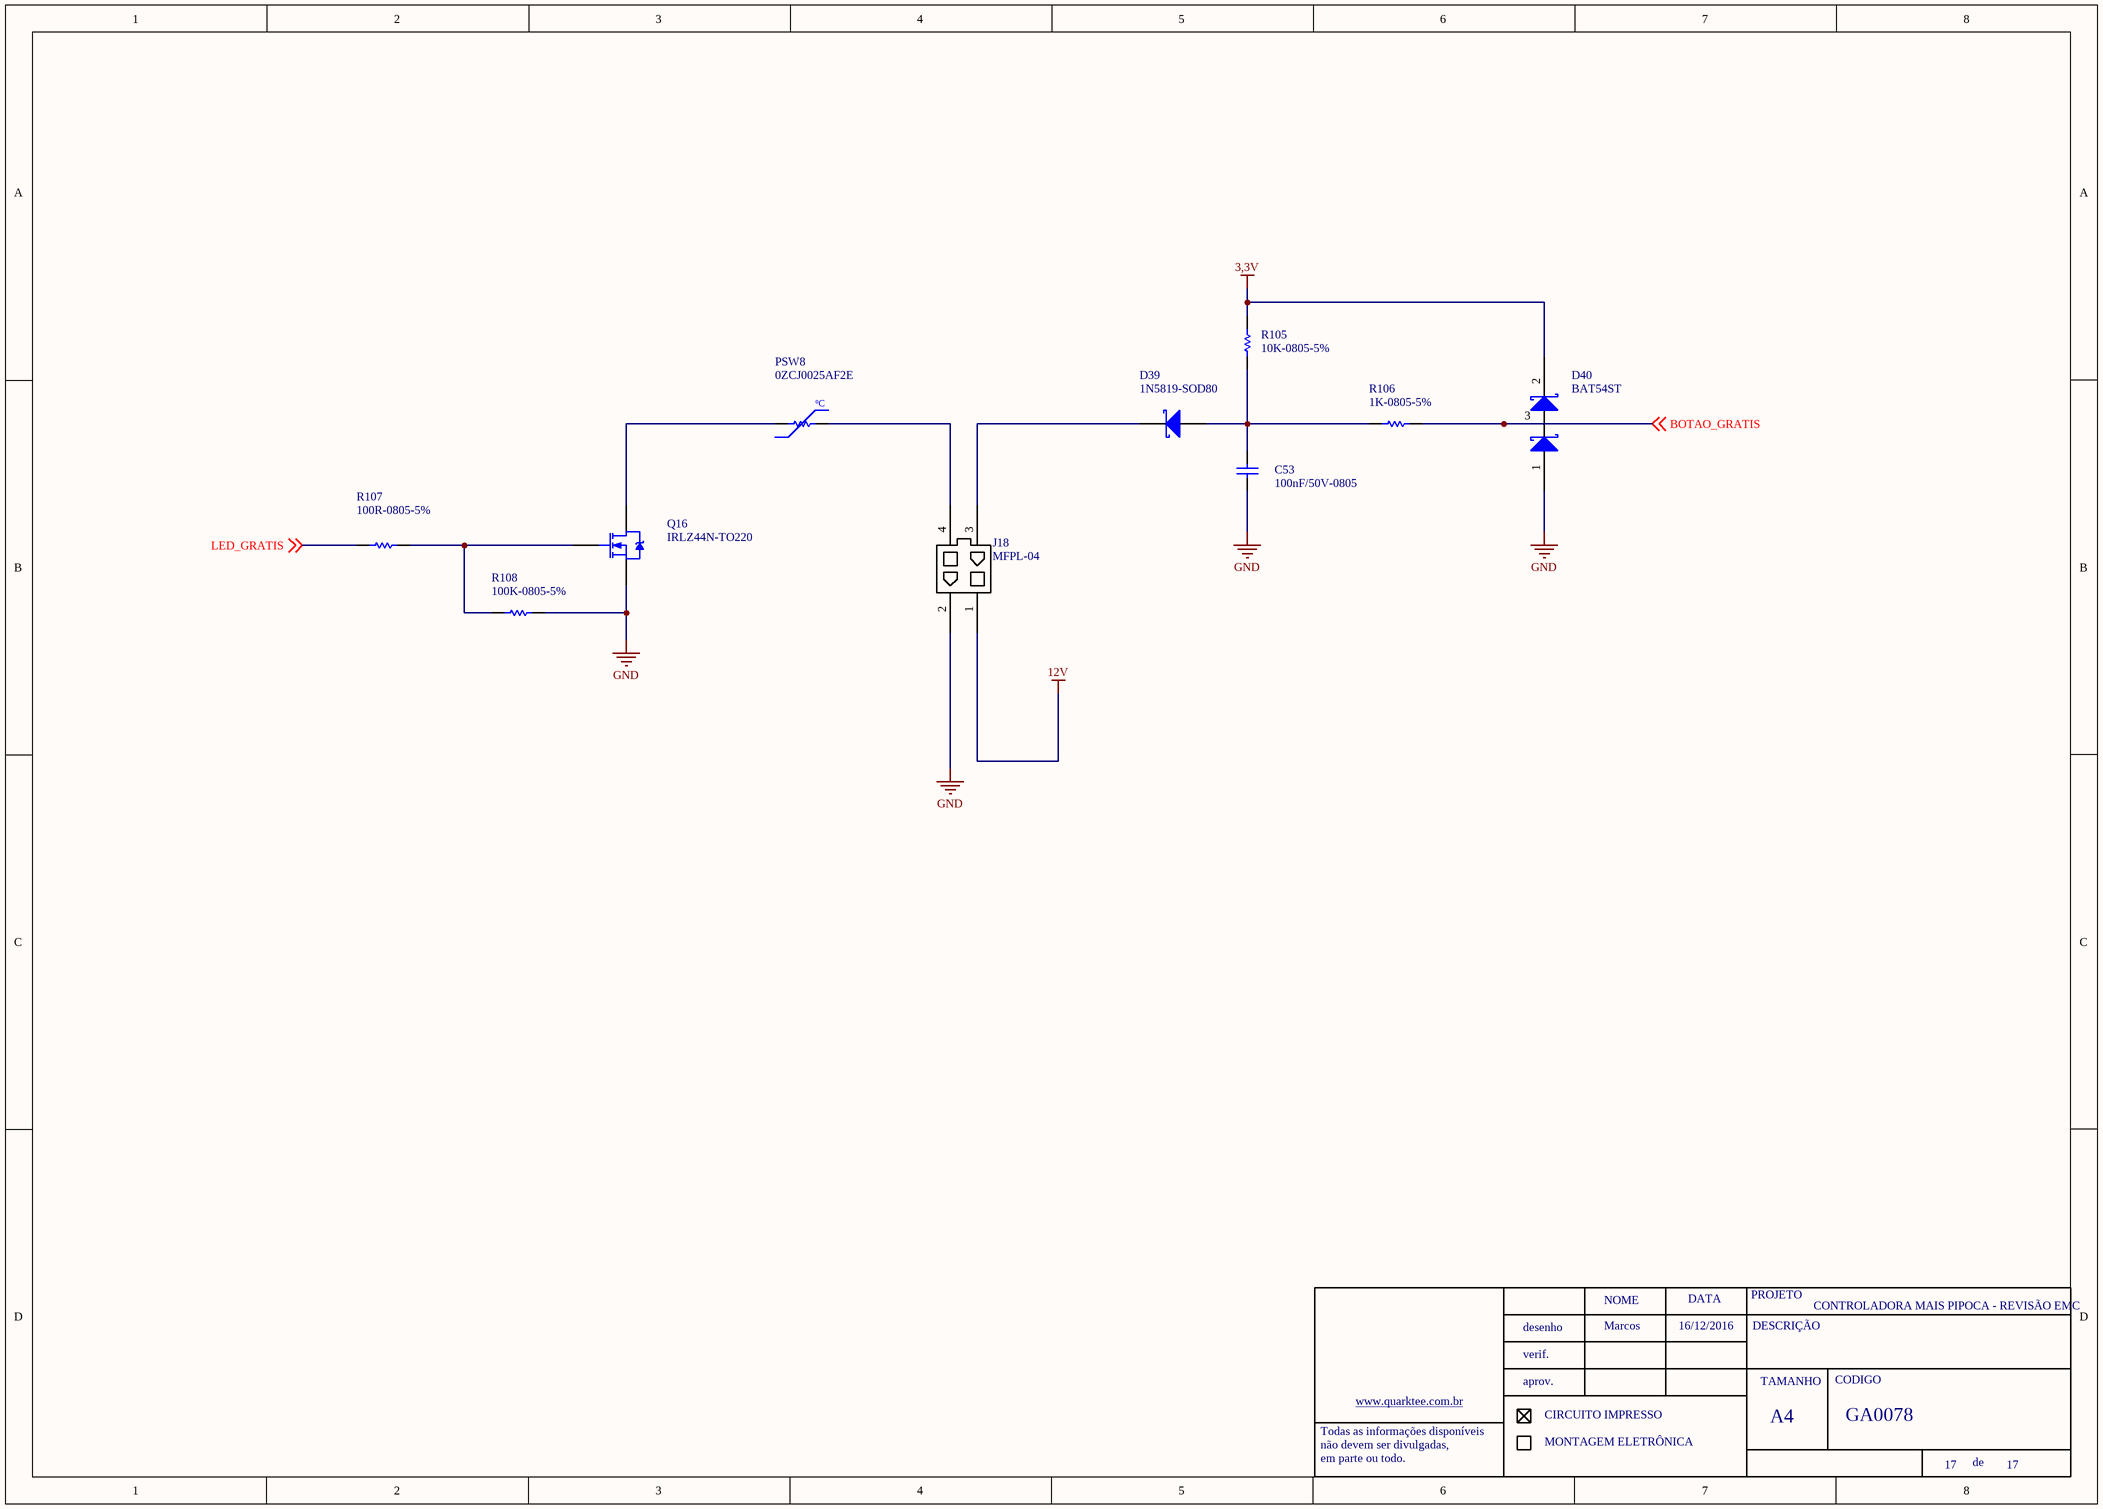
[diagram p6: Interface_gratis.SchDoc]

### Parts
C53  100nF/50V-0805  [0805-REVISADO ONDA]
D39  1N5819-SOD80  [MINIMLEF/SOD80 - REVISADO ONDA]
D40  BAT54ST  [SOT23 - REVISADO ONDA]
J18  MFPL-04
PSW8  0ZCJ0025AF2E  [1206-REVISADO ONDA]
Q16  IRLZ44N-TO220  [TO220-3 EM PÉ]
R105  10K-0805-5%  [0805-REVISADO ONDA]
R106  1K-0805-5%  [0805-REVISADO ONDA]
R107  100R-0805-5%  [0805-REVISADO ONDA]
R108  100K-0805-5%  [0805-REVISADO ONDA]

### Nets
3,3V: D40.2 R105.2
12V: J18.1
GND: C53.1 D40.1 J18.2 Q16.3(S) R108.2
BOTAO_GRATIS: D40.3 R106.2 ; off-sheet BOTAO_GRATIS
LED_GRATIS: R107.1 ; off-sheet LED_GRATIS
NetC53_2: C53.2 D39.1(A) R105.1 R106.1
NetD39_2: D39.2(K) J18.3
NetJ18_4: J18.4 PSW8.2
NetPSW8_1: PSW8.1 Q16.2(D)
NetQ16_1: Q16.1(G) R107.2 R108.1

### Notes on the sheet
- Marcos
- 16/12/2016
- NOME
- DATA
- PROJETO
- DESCRIÇÃO
- desenho
- verif.
- aprov.
- TAMANHO
- CODIGO
- Todas as informações disponíveis
- não devem ser divulgadas,
- em parte ou todo.
- www.quarktee.com.br
- CIRCUITO IMPRESSO
- MONTAGEM ELETRÔNICA
- A4
- de
- (in symbol PTC 2A-120V) ºC

### Library data of the parts
C53 = 100nF/50-0805-NPO: ERP: 104.11.005
PSW8 = PTC 2A-120V
D39 = 1N5819-SOD80: ERP: 121.18.003
Q16 = IRLZ44N-TO220: ERP: 107.01.006
R105 = 10K-0805-5%: ERP: 102.11.054
R106 = 1K-0805-5%: ERP: 102.11.042
R107 = 100R-0805-5%: ERP: 102.11.031
R108 = 100K-0805-5%: ERP: 102.11.066

## Sheet InterfaceConfiguracao.SchDoc: CONTROLADORA MAIS PIPOCA - REVISÃO EMC
size A3; DocumentNumber: GA0078; SheetNumber: 10; SheetTotal: 17
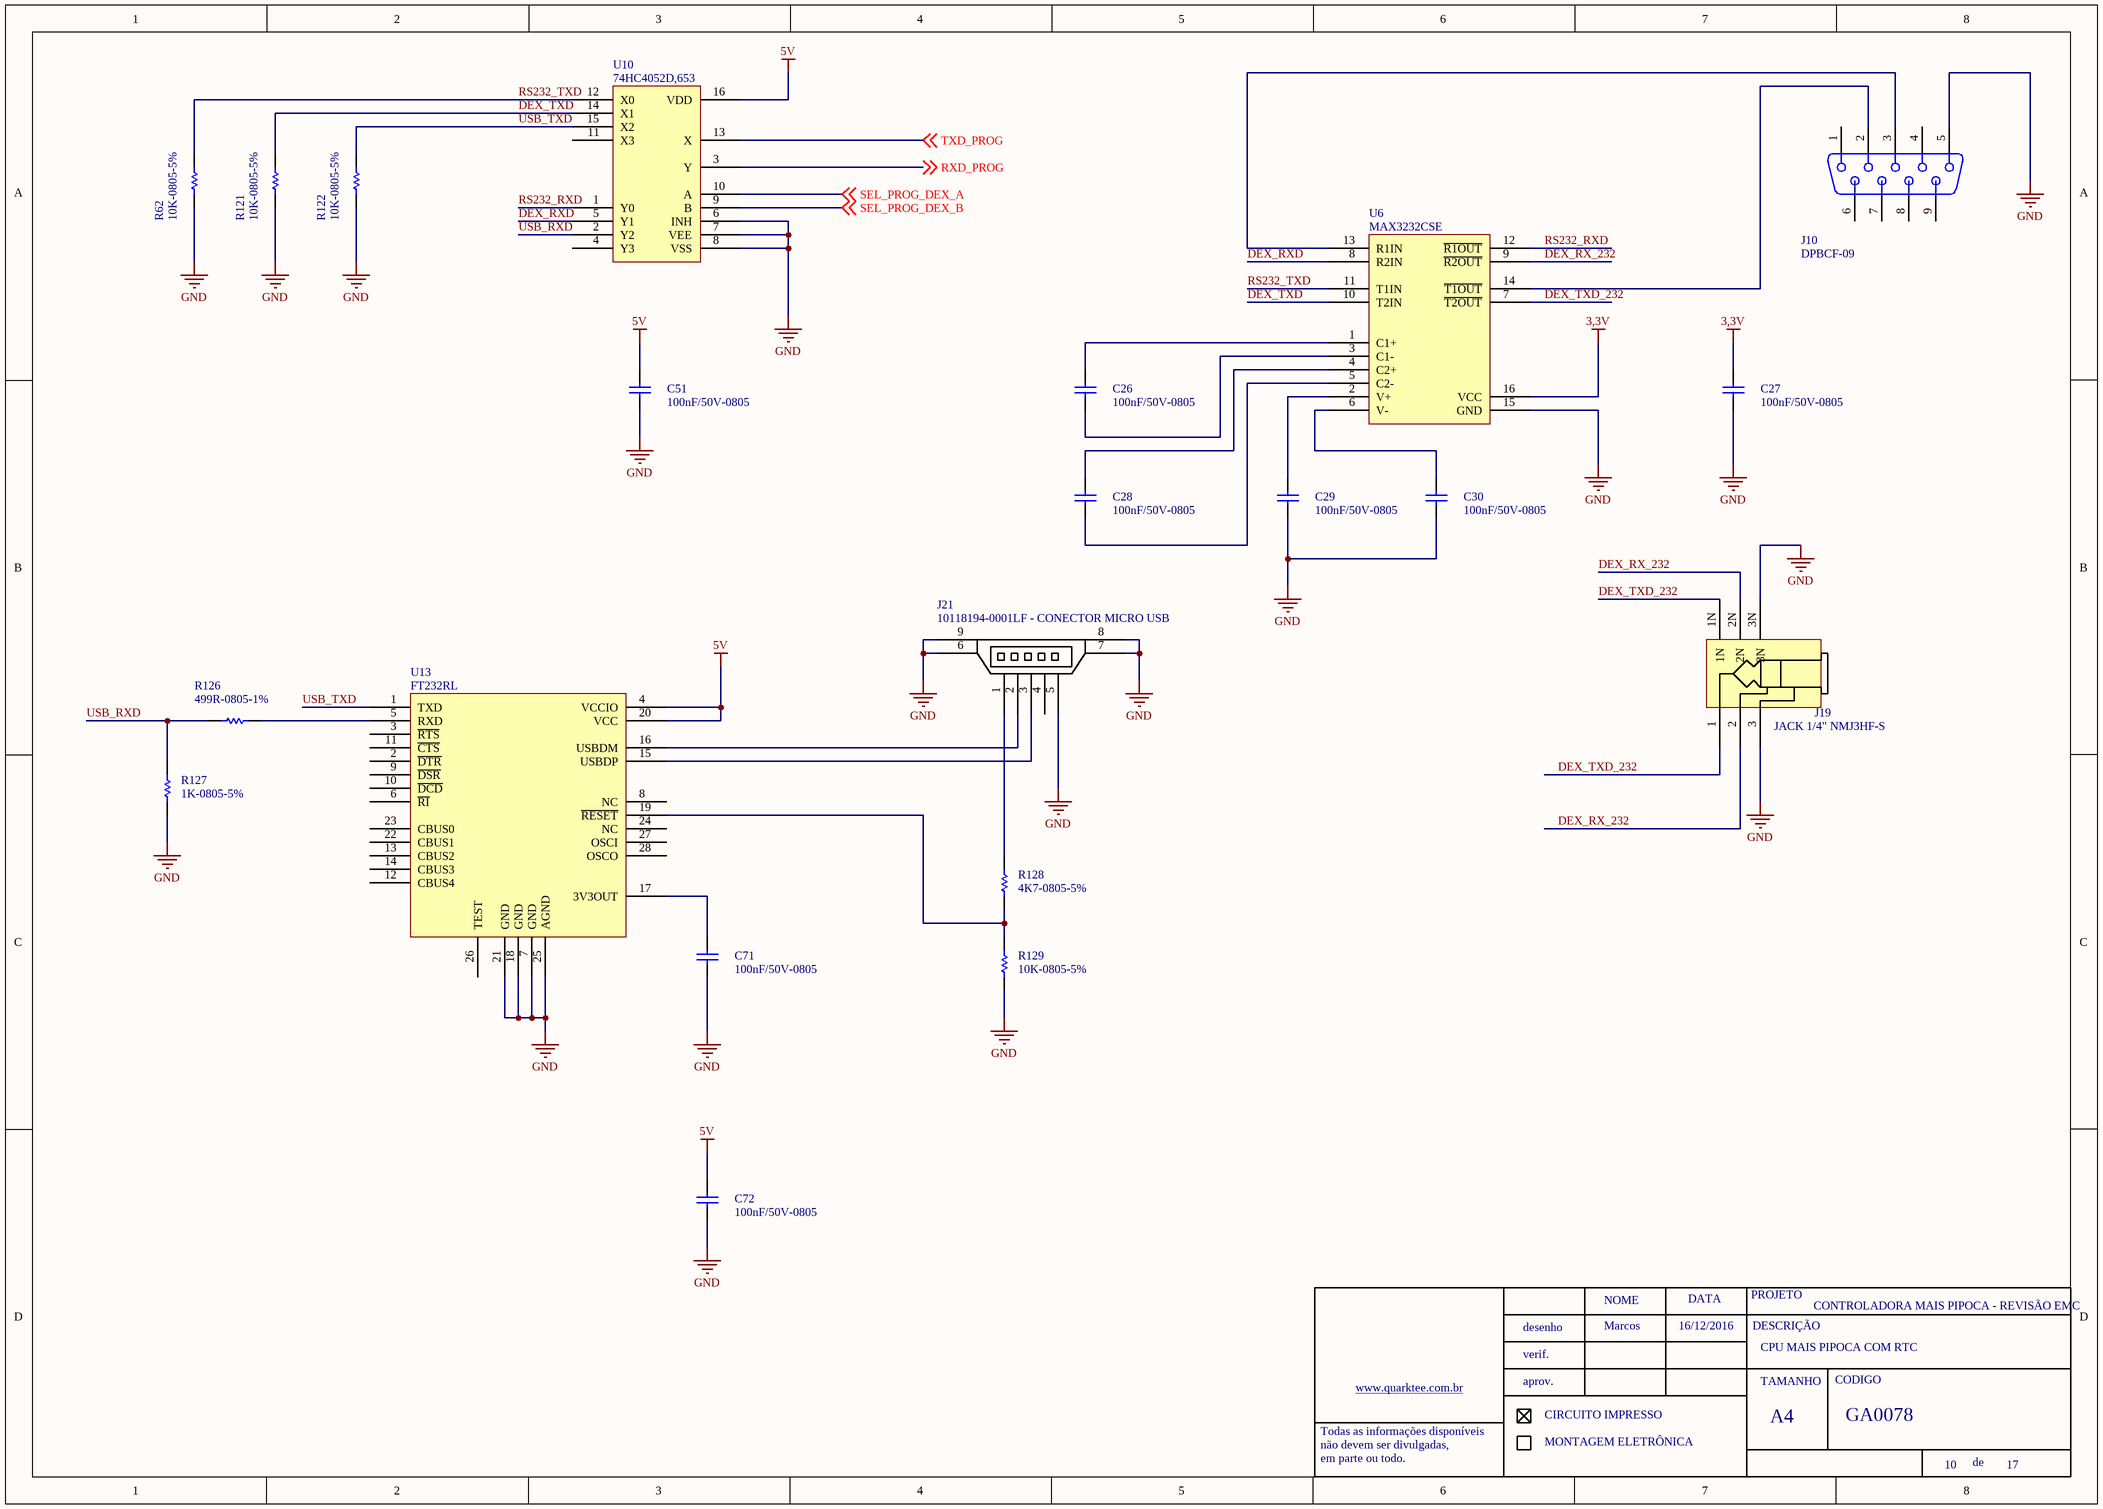
[diagram p7: InterfaceConfiguracao.SchDoc]

### Parts
C26  100nF/50V-0805  [0805-REVISADO ONDA]
C27  100nF/50V-0805  [0805-REVISADO ONDA]
C28  100nF/50V-0805  [0805-REVISADO ONDA]
C29  100nF/50V-0805  [0805-REVISADO ONDA]
C30  100nF/50V-0805  [0805-REVISADO ONDA]
C51  100nF/50V-0805  [0805-REVISADO ONDA]
C71  100nF/50V-0805  [0805-REVISADO ONDA]
C72  100nF/50V-0805  [0805-REVISADO ONDA]
J10  DPBCF-09  [DB9-FÊMEA MONTAGEM EM PCI 180]
J19  JACK 1/4" NMJ3HF-S
J21  10118194-0001LF - CONECTOR MICRO USB
R62  10K-0805-5%  [0805-REVISADO ONDA]
R121  10K-0805-5%  [0805-REVISADO ONDA]
R122  10K-0805-5%  [0805-REVISADO ONDA]
R126  499R-0805-1%  [0805-REVISADO ONDA]
R127  1K-0805-5%  [0805-REVISADO ONDA]
R128  4K7-0805-5%  [0805-REVISADO ONDA]
R129  10K-0805-5%  [0805-REVISADO ONDA]
U6  MAX3232CSE  [SOIC 16 PINOS]
U10  74HC4052D,653
U13  FT232RL

### Nets
3,3V: C27.2 U6.16(VCC)
5V: C51.2 C72.2 U10.16(VDD) U13.4(VCCIO) U13.20(VCC)
GND: C27.1 C29.1 C30.1 C51.1 C71.1 C72.1 J10.5 J19.3 J19.3N J21.5 J21.6 J21.7 J21.8 J21.9 R62.1 R121.1 R122.1 R127.1 R129.1 U6.15(GND) U10.6(INH) U10.7(VEE) U10.8(VSS) U13.7(GND) U13.18(GND) U13.21(GND) U13.25(AGND)
DEX_RX_232: J19.2 J19.2N U6.9(~{R2OUT})
DEX_RXD: U6.8(R2IN) U10.5(Y1)
DEX_TXD: R121.2 U6.10(T2IN) U10.14(X1)
DEX_TXD_232: J19.1 J19.1N U6.7(~{T2OUT})
RS232_RXD: U6.12(~{R1OUT}) U10.1(Y0)
RS232_TXD: R62.2 U6.11(T1IN) U10.12(X0)
RXD_PROG: U10.3(Y) ; off-sheet RXD_PROG
SEL_PROG_DEX_A: U10.10(A) ; off-sheet SEL_PROG_DEX_A
SEL_PROG_DEX_B: U10.9(B) ; off-sheet SEL_PROG_DEX_B
TXD_PROG: U10.13(X) ; off-sheet TXD_PROG
USB_RXD: R126.1 R127.2 U10.2(Y2)
USB_TXD: R122.2 U10.15(X2) U13.1(TXD)
NetC26_1: C26.1 U6.3(C1-)
NetC26_2: C26.2 U6.1(C1+)
NetC28_1: C28.1 U6.5(C2-)
NetC28_2: C28.2 U6.4(C2+)
NetC29_2: C29.2 U6.2(V+)
NetC30_2: C30.2 U6.6(V-)
NetC71_2: C71.2 U13.17(3V3OUT)
NetJ10_2: J10.2 U6.14(~{T1OUT})
NetJ10_3: J10.3 U6.13(R1IN)
NetJ21_1: J21.1 R128.2
NetJ21_2: J21.2 U13.16(USBDM)
NetJ21_3: J21.3 U13.15(USBDP)
NetR126_2: R126.2 U13.5(RXD)
NetR128_1: R128.1 R129.2 U13.19(~{RESET})

Not connected (* = marked no-connect by the designer): J10 1 4 6 7 8 9; J21 4; U10 4(Y3) 11(X3); U13 2(~{DTR}) 3(~{RTS}) 6(~{RI}) 8(NC) 9(~{DSR}) 10(~{DCD}) 11(~{CTS}) 12(CBUS4) 13(CBUS2) 14(CBUS3) 22(CBUS1) 23(CBUS0) 24(NC) 26(TEST) 27(OSCI) 28(OSCO)

### Notes on the sheet
- Marcos
- 16/12/2016
- CPU MAIS PIPOCA COM RTC
- NOME
- DATA
- PROJETO
- DESCRIÇÃO
- www.quarktee.com.br
- desenho
- verif.
- aprov.
- TAMANHO
- CODIGO
- Todas as informações disponíveis
- não devem ser divulgadas,
- em parte ou todo.
- CIRCUITO IMPRESSO
- MONTAGEM ELETRÔNICA
- A4
- de

### Library data of the parts
C26-C30 C51 C71 C72 = 100nF/50-0805-NPO: ERP: 104.11.005
J10 = DB-9 - FÊMEA 180º MONTAGEM EM PCI: DBPCF-09; ERP: 434.00.002
J19 = NMJ3HF-S
J21 = MINI_USB
R126 = 1K-0805-5%: ERP: 102.11.042
R128 = 10K-0805-5%: ERP: 102.11.054
U10 = CD74HC4052PWR
R62 R121 R122 R129 = 10K-0805-5%: ERP: 102.11.054
R127 = 1K-0805-5%: ERP: 102.11.042
U6 = MAX3232CSE: ERP: 110.02.001

## Sheet Memoria.SchDoc: CONTROLADORA MAIS PIPOCA - REVISÃO EMC
size A3; DocumentNumber: GA0078; SheetNumber: 15; SheetTotal: 17
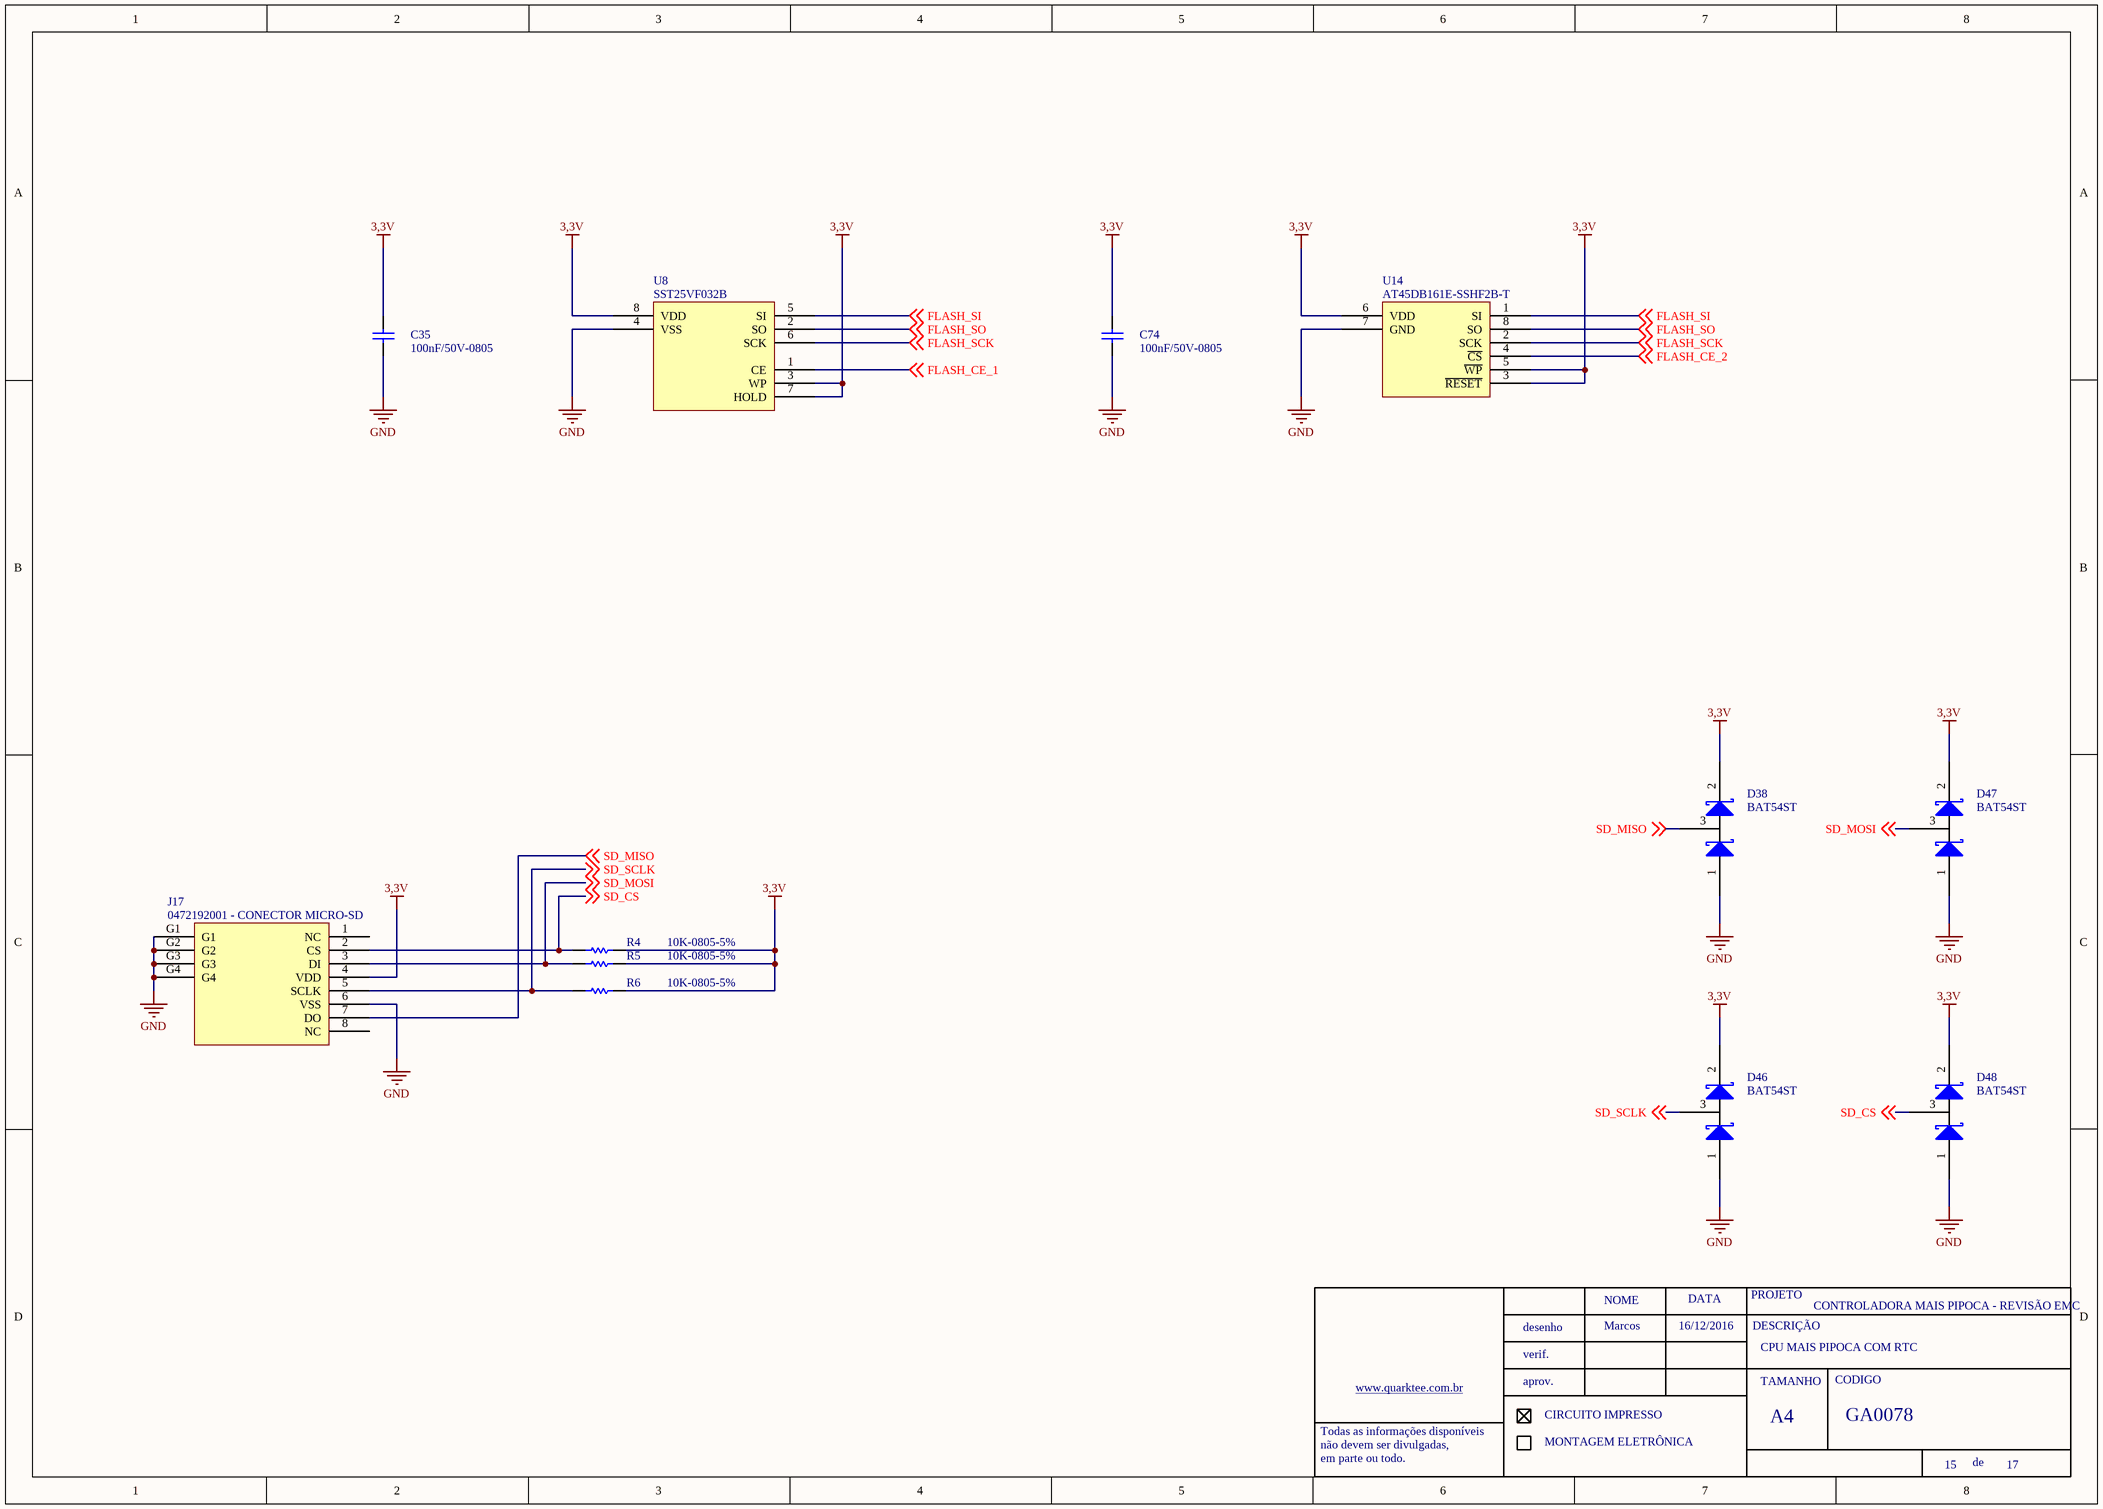
[diagram p8: Memoria.SchDoc]

### Parts
C35  100nF/50V-0805  [0805-REVISADO ONDA]
C74  100nF/50V-0805  [0805-REVISADO ONDA]
D38  BAT54ST  [SOT23 - REVISADO ONDA]
D46  BAT54ST  [SOT23 - REVISADO ONDA]
D47  BAT54ST  [SOT23 - REVISADO ONDA]
D48  BAT54ST  [SOT23 - REVISADO ONDA]
J17  0472192001 - CONECTOR MICRO-SD
R4  10K-0805-5%  [0805-REVISADO ONDA]
R5  10K-0805-5%  [0805-REVISADO ONDA]
R6  10K-0805-5%  [0805-REVISADO ONDA]
U8  SST25VF032B  [SOIC LARGO ATMEL]
U14  AT45DB161E-SSHF2B-T

### Nets
3,3V: C35.2 C74.2 D38.2 D46.2 D47.2 D48.2 J17.4(VDD) R4.1 R5.1 R6.1 U8.3(WP) U8.7(HOLD) U8.8(VDD) U14.3(~{RESET}) U14.5(~{WP}) U14.6(VDD)
GND: C35.1 C74.1 D38.1 D46.1 D47.1 D48.1 J17.6(VSS) J17.G1 J17.G2 J17.G3 J17.G4 U8.4(VSS) U14.7(GND)
FLASH_CE_1: U8.1(CE) ; off-sheet FLASH_CE_1
FLASH_CE_2: U14.4(~{CS}) ; off-sheet FLASH_CE_2
FLASH_SCK: U8.6(SCK) U14.2(SCK) ; off-sheet FLASH_SCK
FLASH_SI: U8.5(SI) U14.1(SI) ; off-sheet FLASH_SI
FLASH_SO: U8.2(SO) U14.8(SO) ; off-sheet FLASH_SO
SD_CS: D48.3 J17.2(CS) R4.2 ; off-sheet SD_CS
SD_MISO: D38.3 J17.7(DO) ; off-sheet SD_MISO
SD_MOSI: D47.3 J17.3(DI) R5.2 ; off-sheet SD_MOSI
SD_SCLK: D46.3 J17.5(SCLK) R6.2 ; off-sheet SD_SCLK

Not connected (* = marked no-connect by the designer): J17 1(NC) 8(NC)

### Notes on the sheet
- Marcos
- 16/12/2016
- CPU MAIS PIPOCA COM RTC
- NOME
- DATA
- PROJETO
- DESCRIÇÃO
- www.quarktee.com.br
- desenho
- verif.
- aprov.
- TAMANHO
- CODIGO
- Todas as informações disponíveis
- não devem ser divulgadas,
- em parte ou todo.
- CIRCUITO IMPRESSO
- MONTAGEM ELETRÔNICA
- A4
- de

### Library data of the parts
C35 C74 = 100nF/50-0805-NPO: ERP: 104.11.005
J17 = CONECTOR MICRO-SD
U8 = SST25VF032B: ERP: FALTA CADASTRAR
R4-R6 = 10K-0805-5%: ERP: 102.11.054

## Sheet Porta_MDB.SchDoc: CONTROLADORA MAIS PIPOCA - REVISÃO EMC
size A3; DocumentNumber: GA0078; SheetNumber: 14; SheetTotal: 17
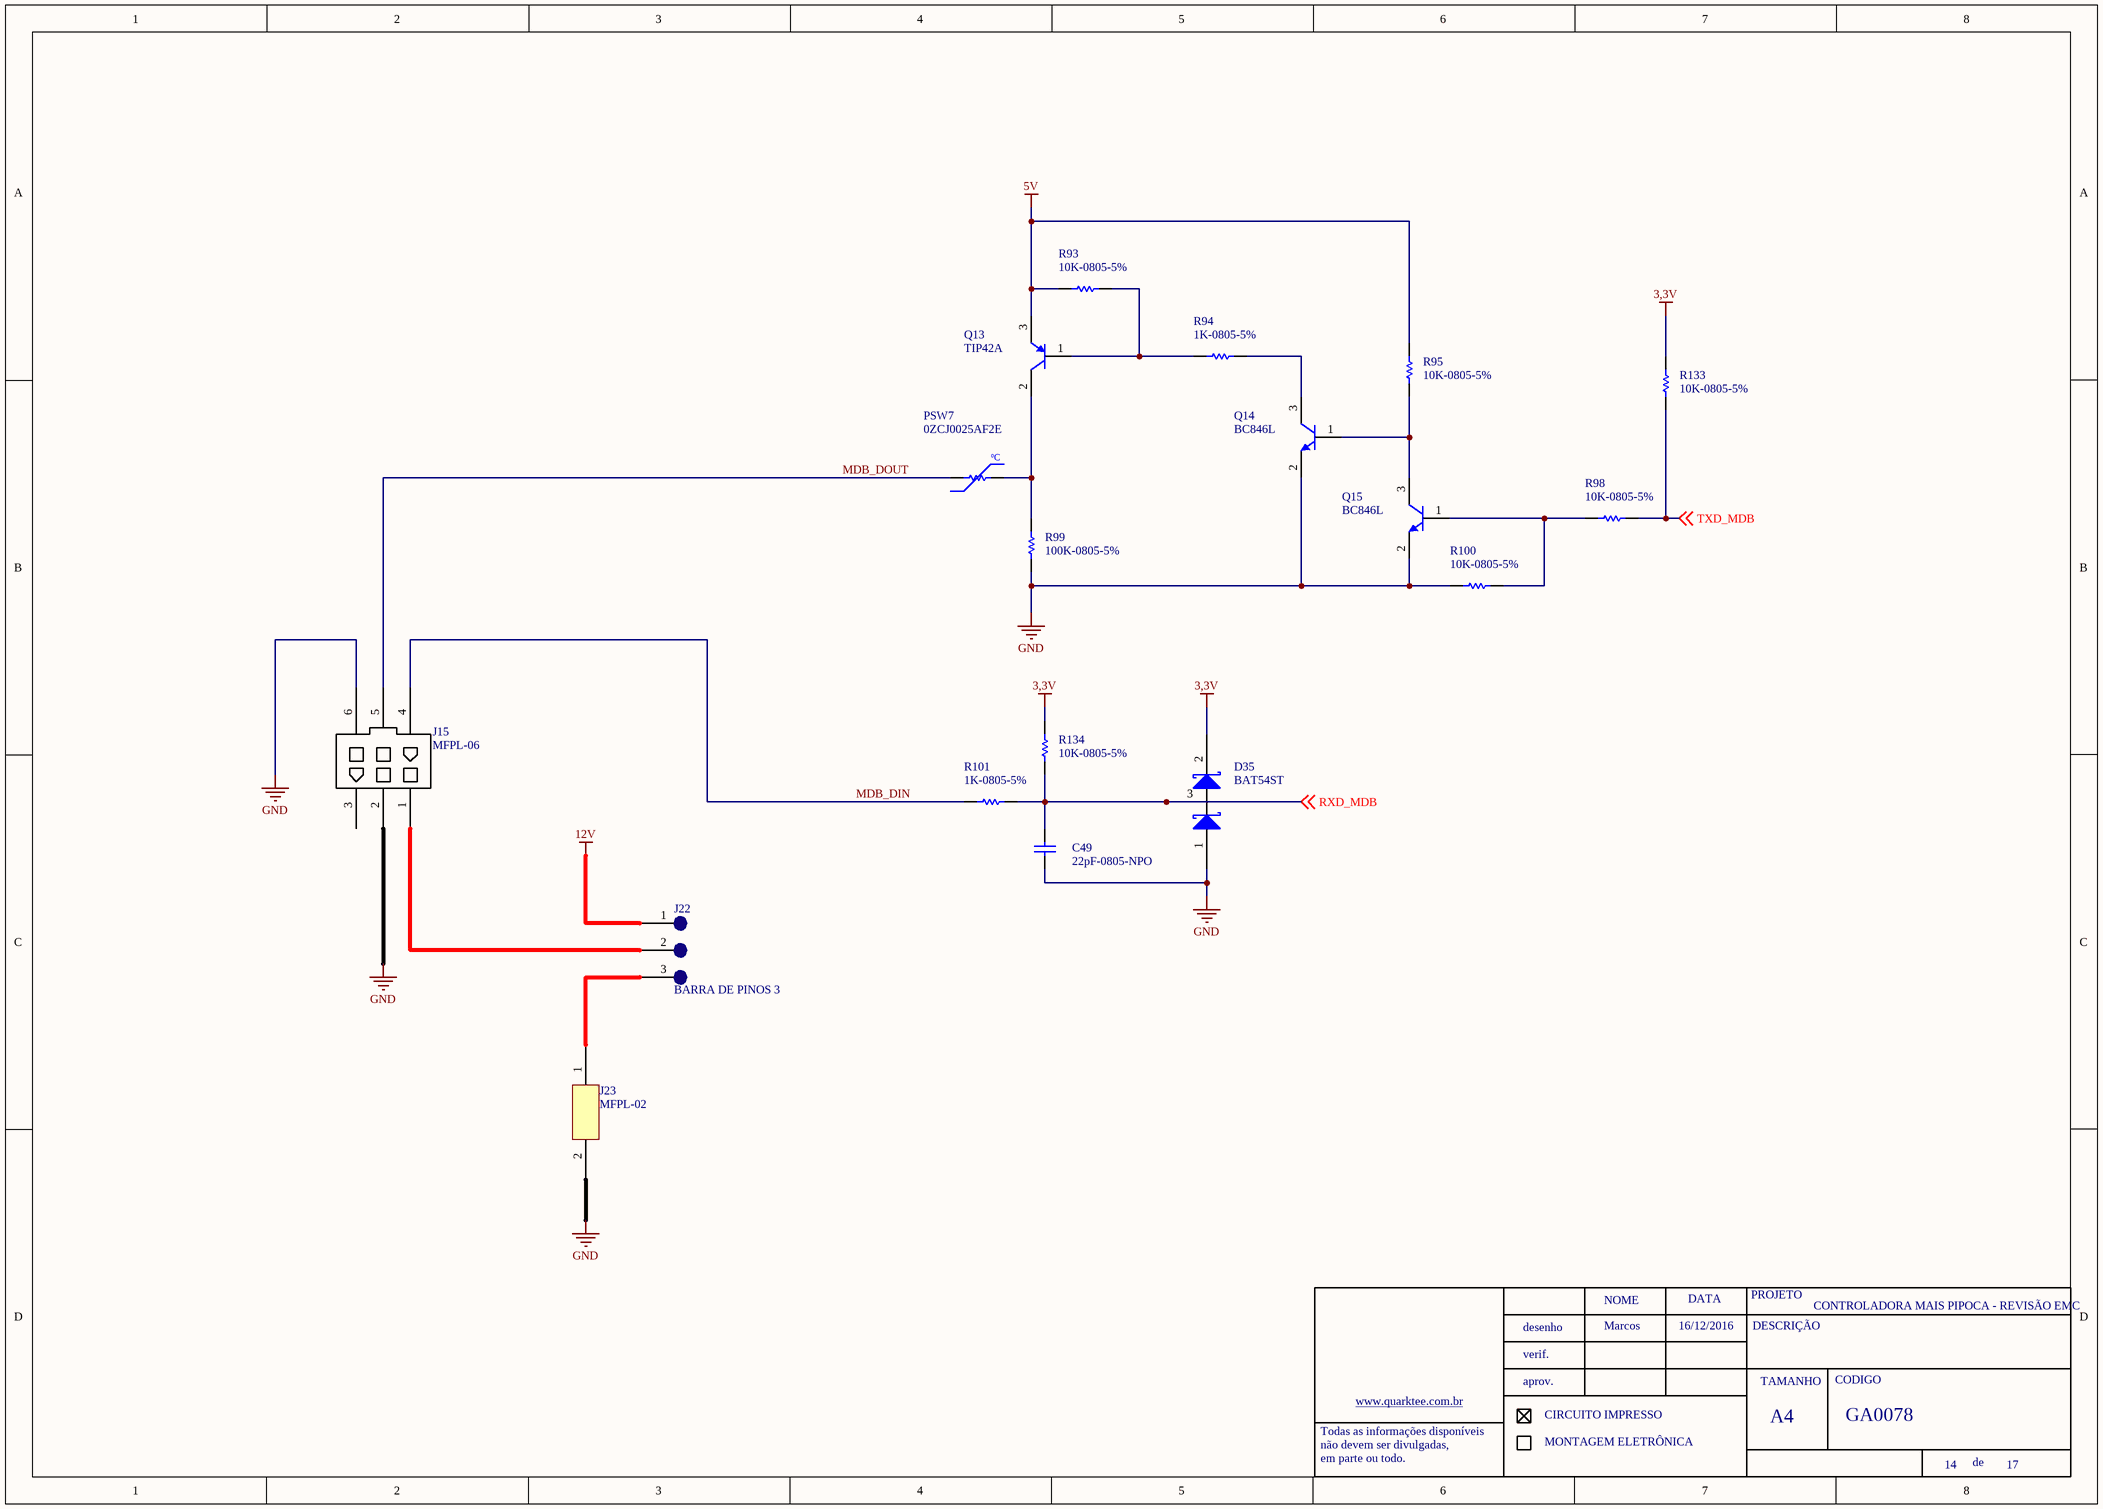
[diagram p9: Porta_MDB.SchDoc]

### Parts
C49  22pF-0805-NPO  [0805-REVISADO ONDA]
D35  BAT54ST  [SOT23 - REVISADO ONDA]
J15  MFPL-06
J22  BARRA DE PINOS 3
J23  MFPL-02
PSW7  0ZCJ0025AF2E  [1206-REVISADO ONDA]
Q13  TIP42A  [DPAK REVISADO ONDA]
Q14  BC846L  [SOT23 - REVISADO ONDA]
Q15  BC846L  [SOT23 - REVISADO ONDA]
R93  10K-0805-5%  [0805-REVISADO ONDA]
R94  1K-0805-5%  [0805-REVISADO ONDA]
R95  10K-0805-5%  [0805-REVISADO ONDA]
R98  10K-0805-5%  [0805-REVISADO ONDA]
R99  100K-0805-5%  [0805-REVISADO ONDA]
R100  10K-0805-5%  [0805-REVISADO ONDA]
R101  1K-0805-5%  [0805-REVISADO ONDA]
R133  10K-0805-5%  [0805-REVISADO ONDA]
R134  10K-0805-5%  [0805-REVISADO ONDA]

### Nets
3,3V: D35.2 R133.2 R134.2
5V: Q13.3(E) R93.1 R95.2
12V: J22.1
GND: C49.1 D35.1 J15.2 J15.6 J23.2 Q14.2(E) Q15.2(E) R99.1 R100.1
MDB_DIN: J15.4 R101.1
MDB_DOUT: J15.5 PSW7.1
RXD_MDB: C49.2 D35.3 R101.2 R134.1 ; off-sheet RXD_MDB
TXD_MDB: R98.2 R133.1 ; off-sheet TXD_MDB
NetJ15_1: J15.1 J22.2
NetJ22_3: J22.3 J23.1
NetPSW7_2: PSW7.2 Q13.2(C) R99.2
NetQ13_1: Q13.1(B) R93.2 R94.1
NetQ14_1: Q14.1(B) Q15.3(C) R95.1
NetQ14_3: Q14.3(C) R94.2
NetQ15_1: Q15.1(B) R98.1 R100.2

Not connected (* = marked no-connect by the designer): J15 3

### Notes on the sheet
- Marcos
- 16/12/2016
- NOME
- DATA
- PROJETO
- DESCRIÇÃO
- desenho
- verif.
- aprov.
- TAMANHO
- CODIGO
- Todas as informações disponíveis
- não devem ser divulgadas,
- em parte ou todo.
- www.quarktee.com.br
- CIRCUITO IMPRESSO
- MONTAGEM ELETRÔNICA
- A4
- de
- (in symbol PTC 2A-120V) ºC

### Library data of the parts
J22 = JUMPER 3
PSW7 = PTC 2A-120V
Q14 Q15 = BC846: ERP: 106.22.001
C49 = 22pF-0805-NPO: ERP: 104.11.001
Q13 = TIP42A: ERP: 107.01.007
R93 R95 R98 R100 R133 R134 = 10K-0805-5%: ERP: 102.11.054
R94 R101 = 1K-0805-5%: ERP: 102.11.042
R99 = 100K-0805-5%: ERP: 102.11.066

## Nets that join several sheets
3,3V: Controle_Cupula (D2.2 R7.2), Controle_placa_potencia (D4.2 D5.2), ControleEmbalagem (5 pins), ControleLeds (C7.2 U2.10 U2.16), Entrada_comestero_rm5 (12 pins), Interface_gratis (D40.2 R105.2), InterfaceConfiguracao (C27.2 U6.16), Memoria (16 pins), Porta_MDB (D35.2 R133.2 R134.2)
5V: ControleEmbalagem (J4.4), InterfaceConfiguracao (5 pins), Porta_MDB (Q13.3 R93.1 R95.2)
12V: Controle_Cupula (PSW1.2), Controle_placa_potencia (J3.1), ControleEmbalagem (J4.1), ControleLeds (J5.1 J6.1 J20.1), Entrada_comestero_rm5 (J13.2 Q11.2 R67.1), Interface_gratis (J18.1), Porta_MDB (J22.1)
GND: Controle_Cupula (13 pins), Controle_placa_potencia (5 pins), ControleEmbalagem (10 pins), ControleLeds (10 pins), Entrada_comestero_rm5 (15 pins), Interface_gratis (5 pins), InterfaceConfiguracao (27 pins), Memoria (13 pins), Porta_MDB (9 pins)